# EAGLE design tarjeta-v3 (EAGLE 6.4)
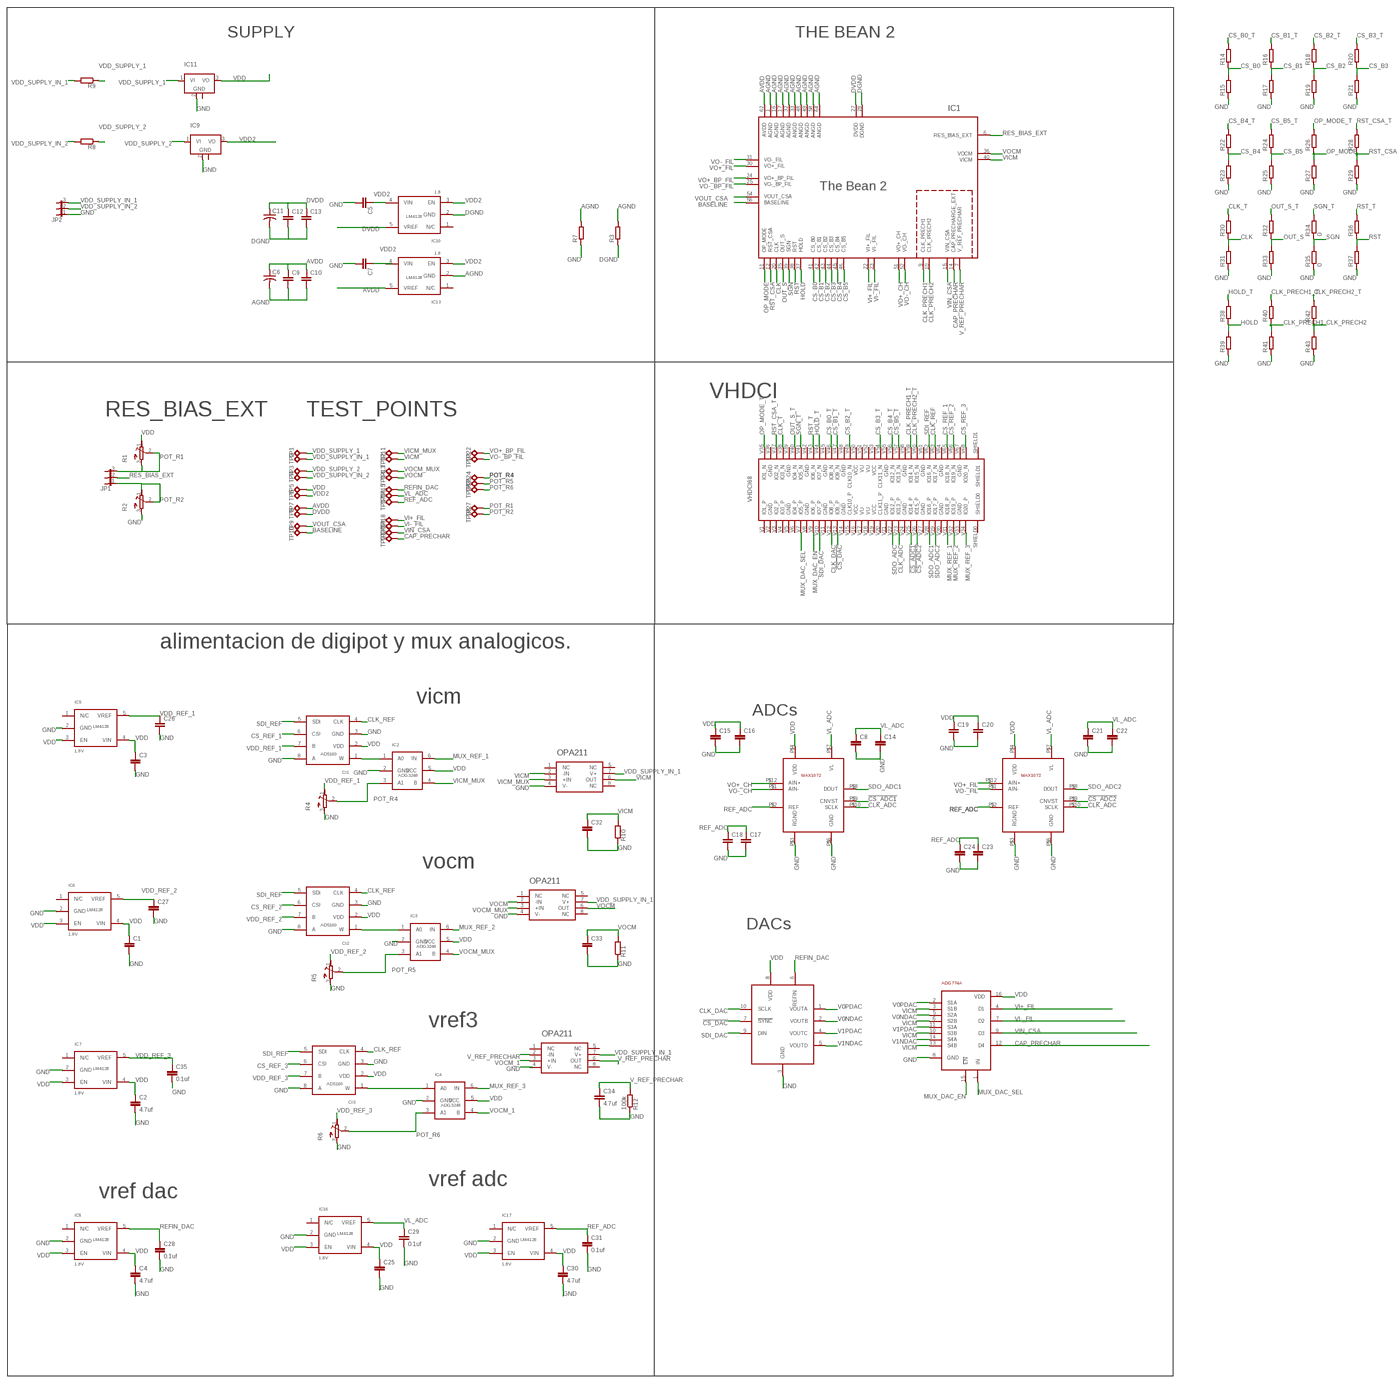
[diagram p0: schematic, sheet 1, overview]
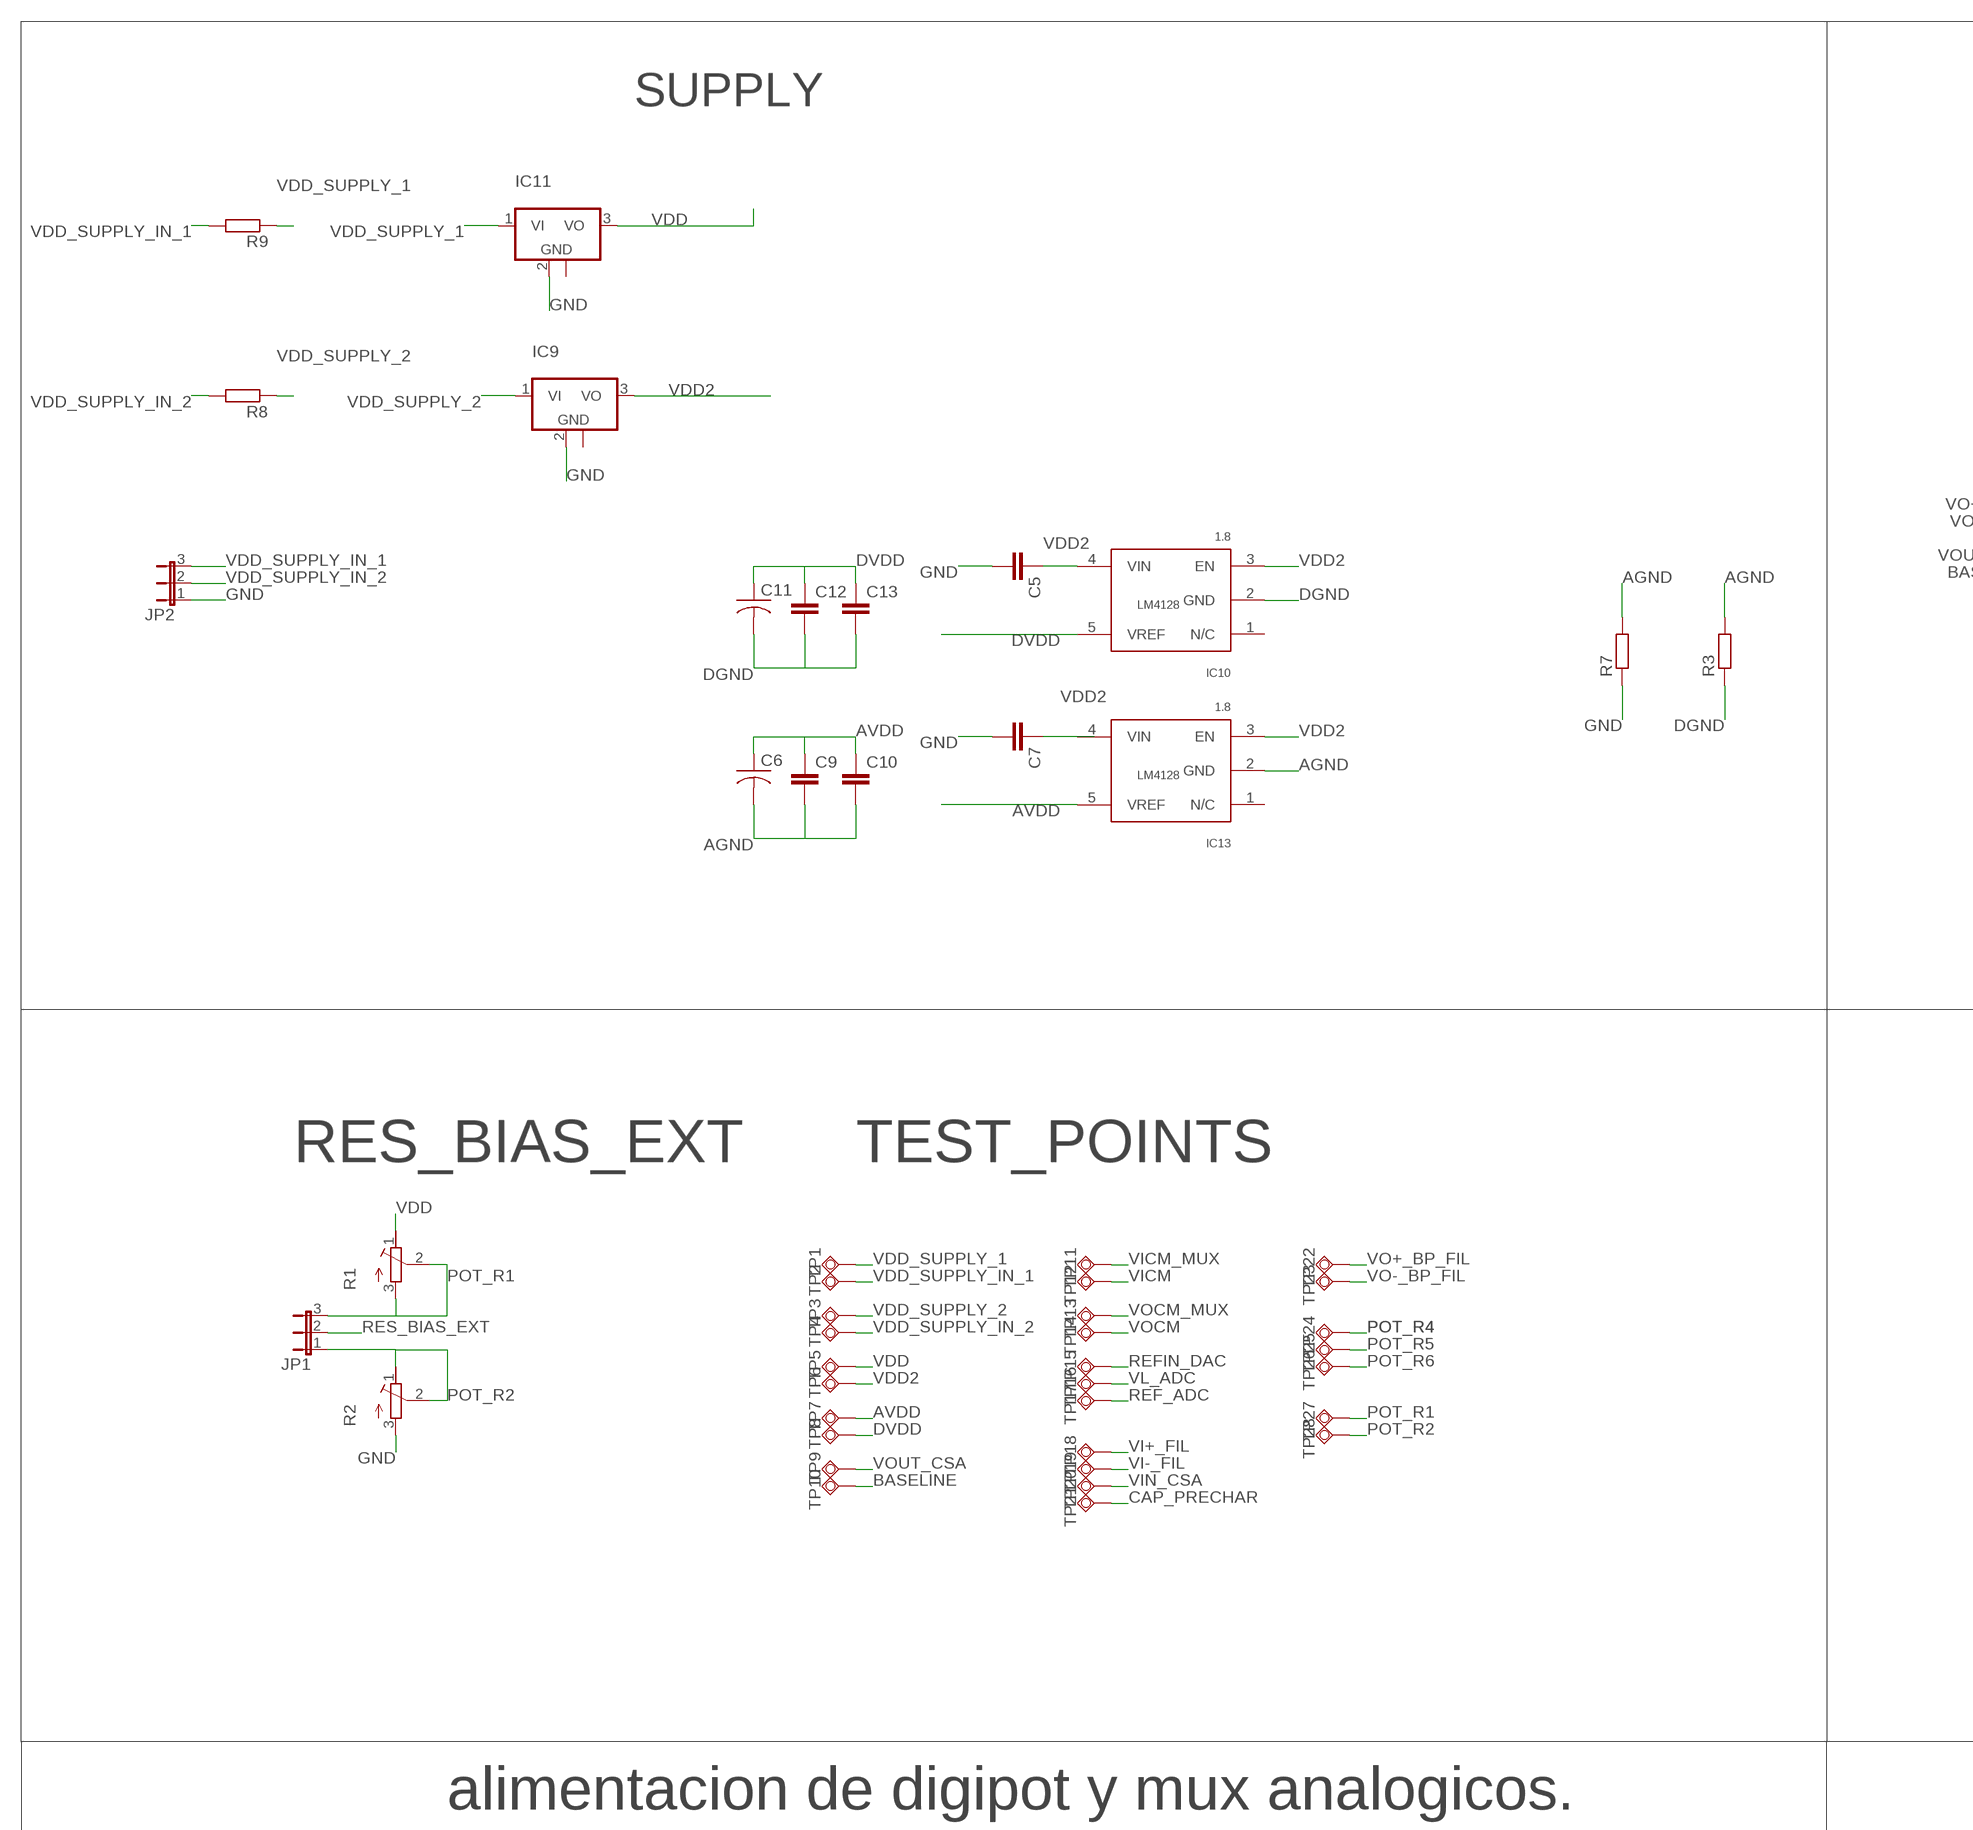
[diagram p1: schematic, sheet 1, part 1 of 4]
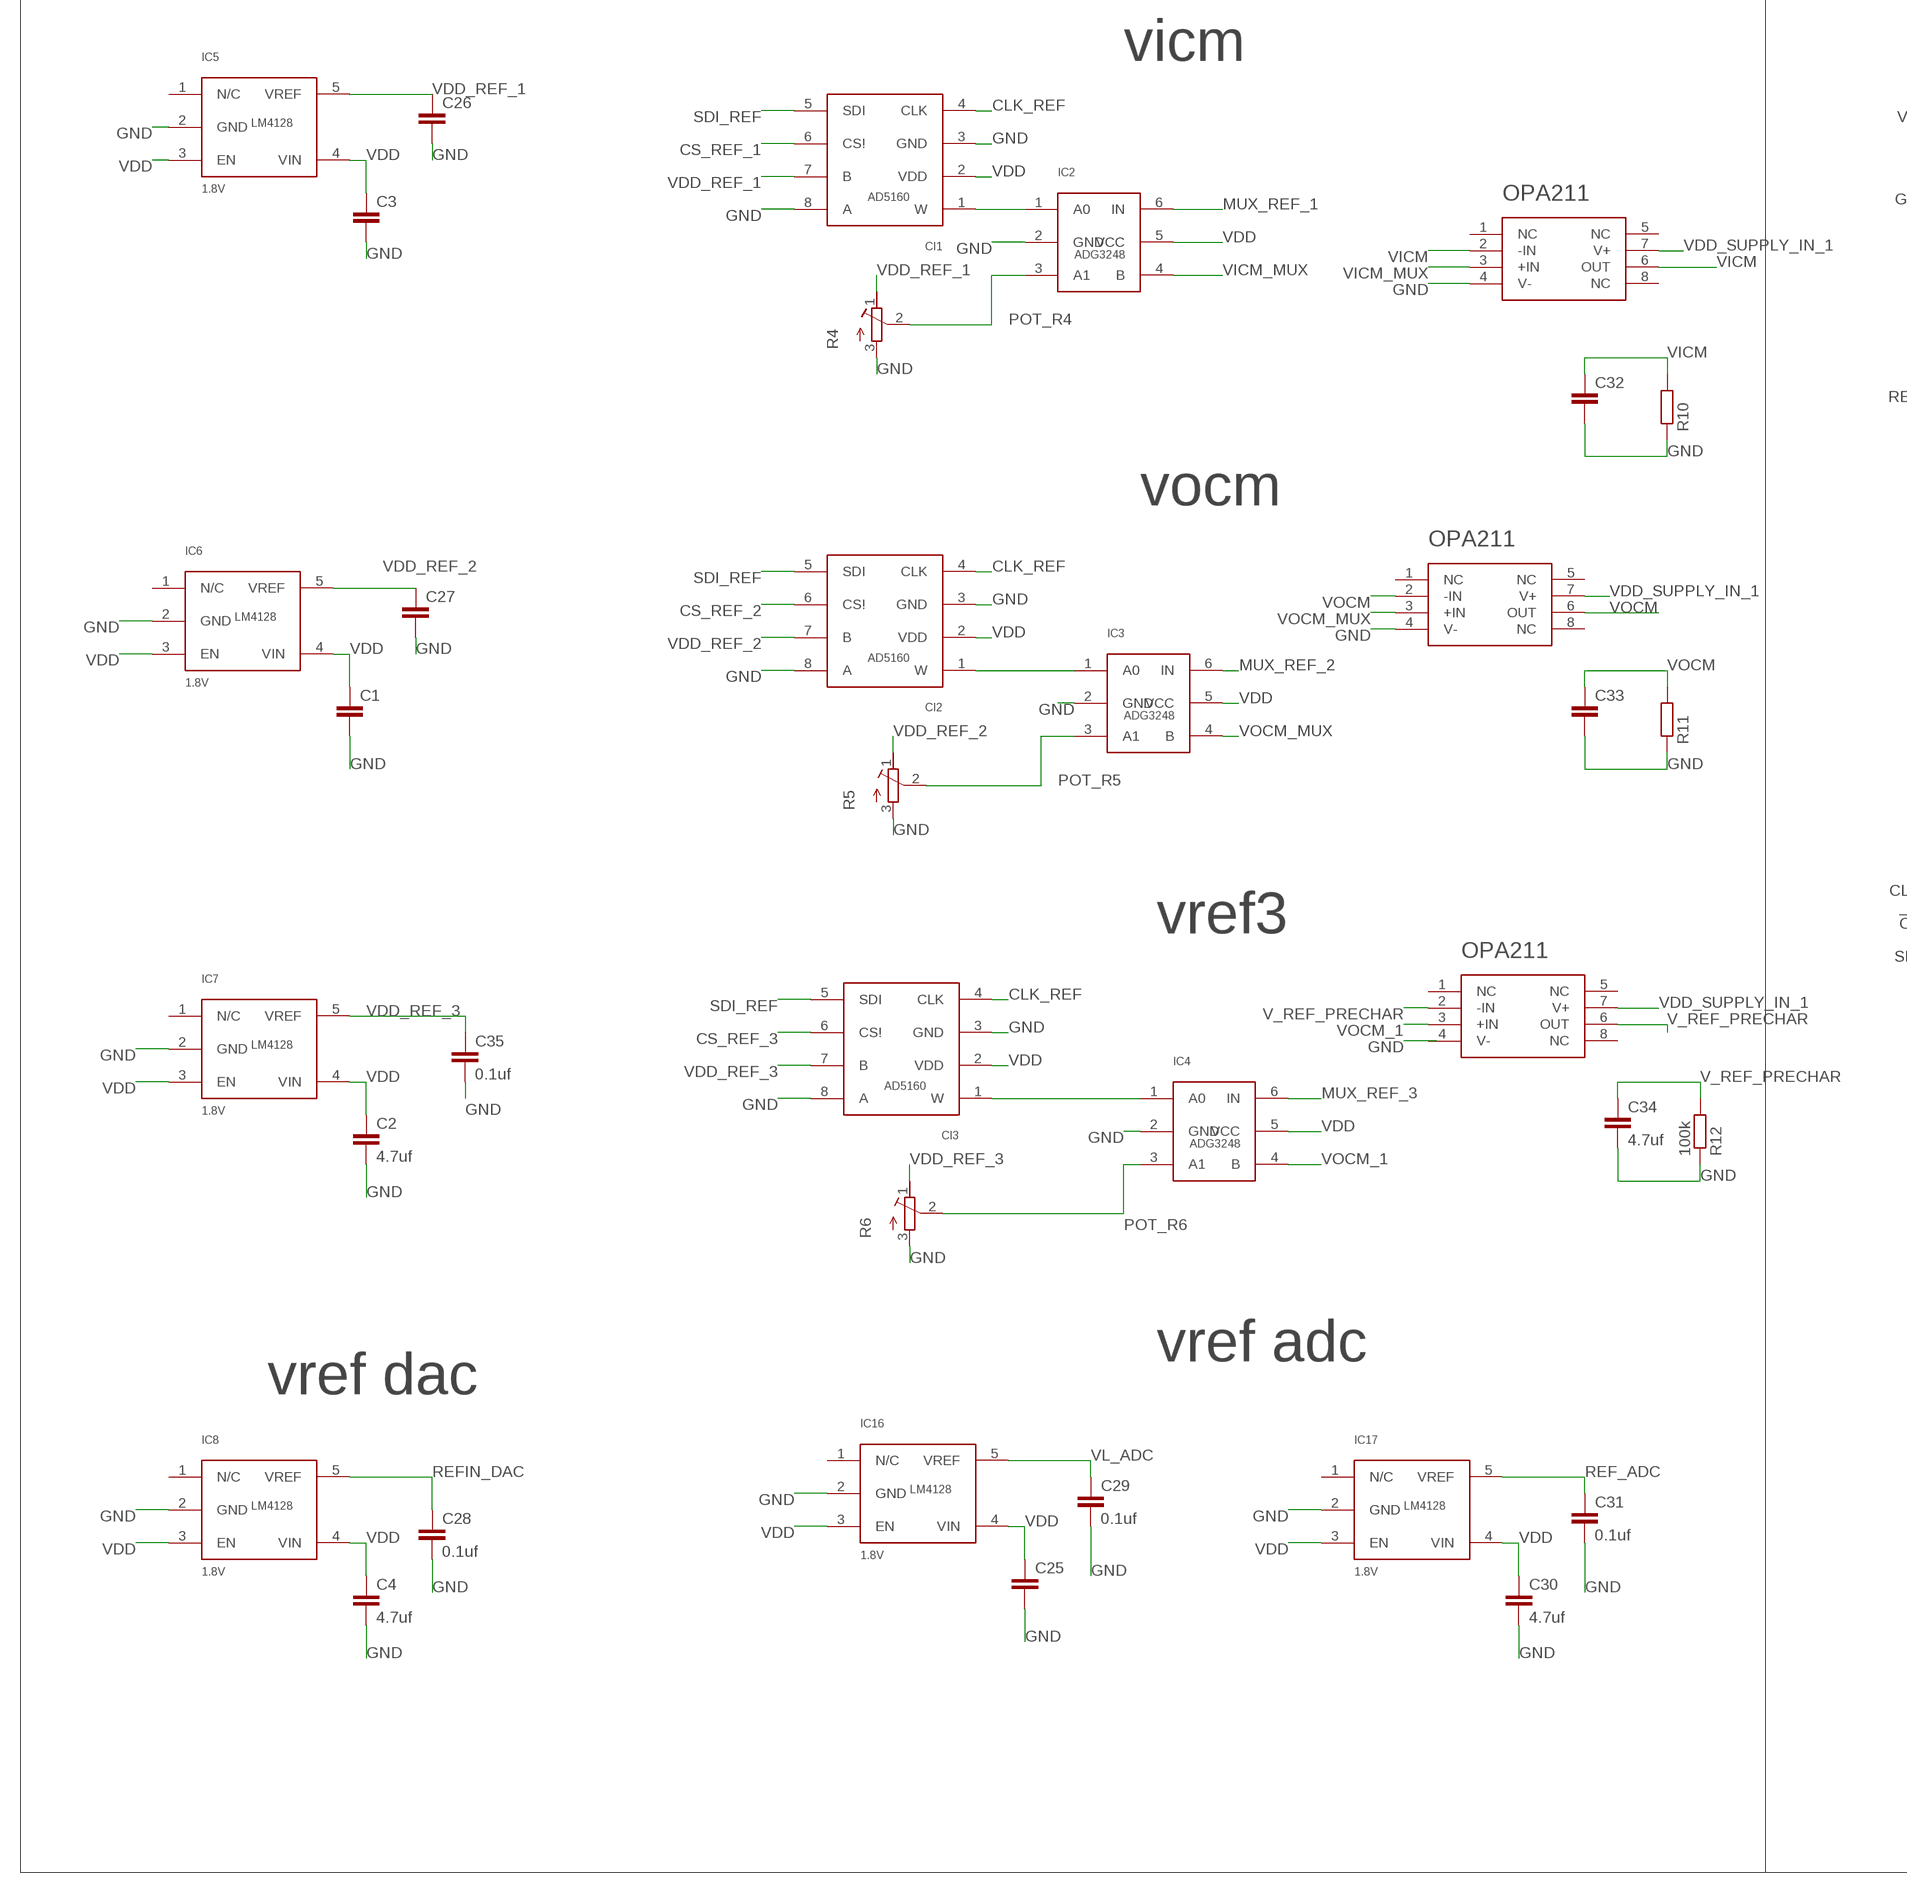
[diagram p2: schematic, sheet 1, part 2 of 4]
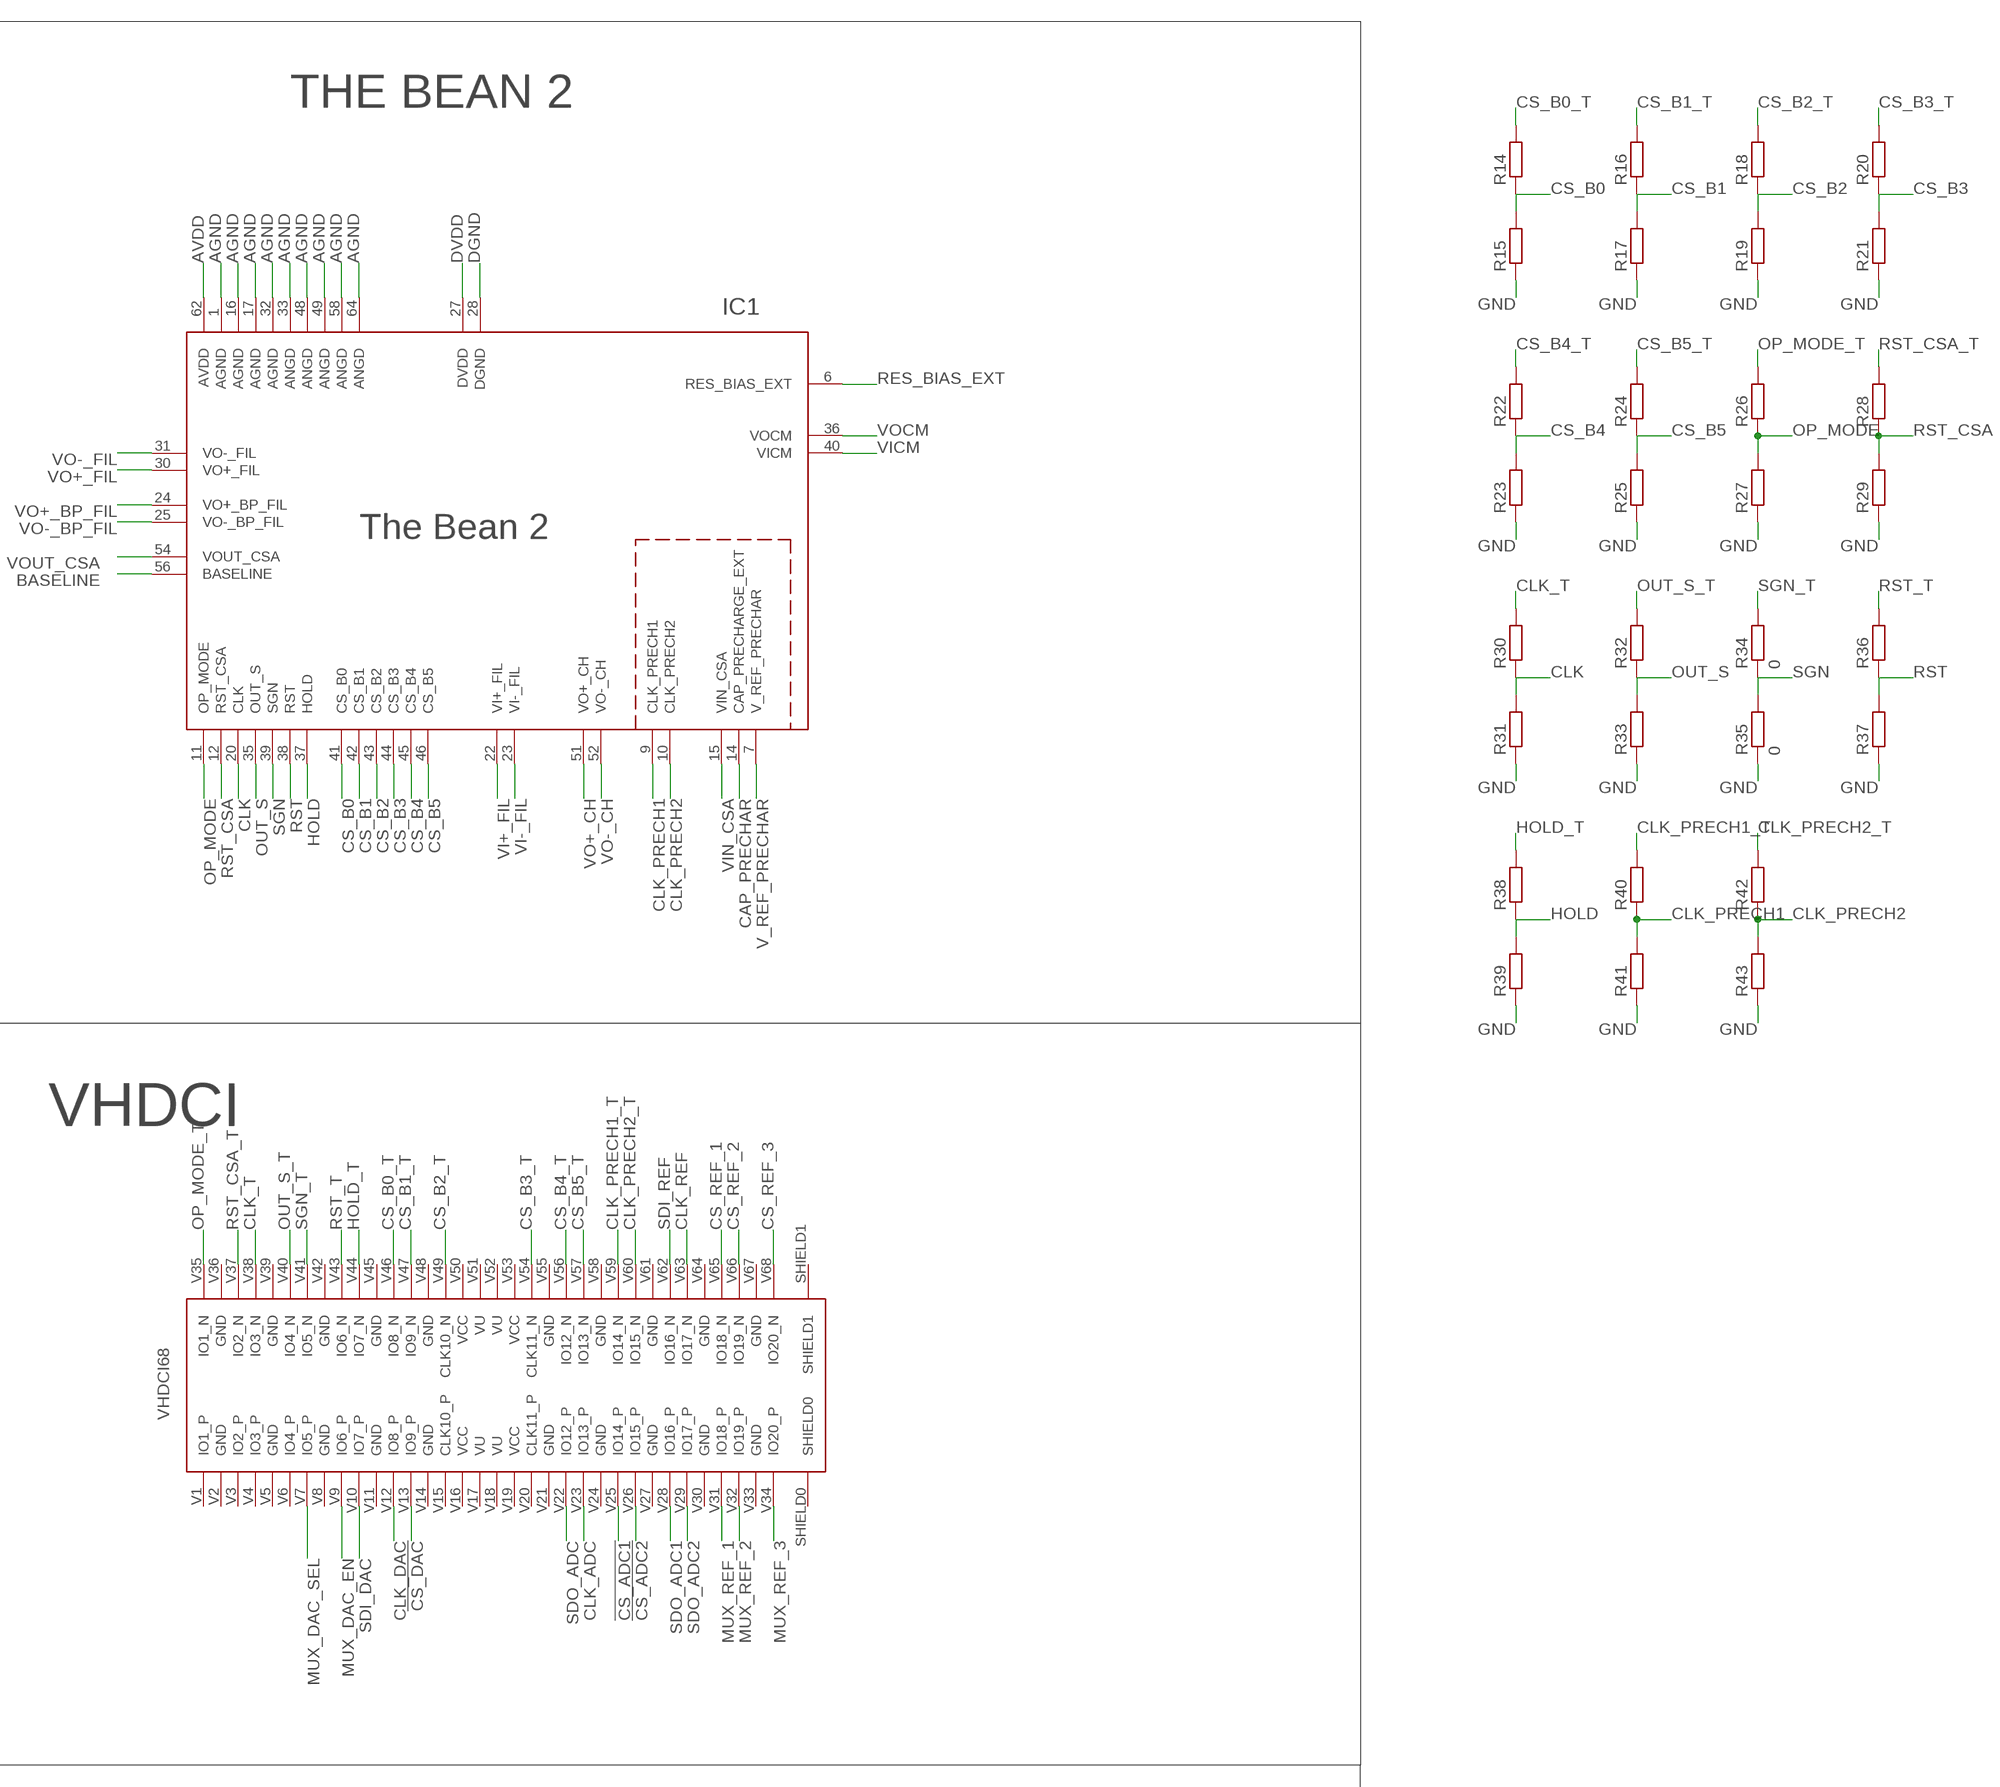
[diagram p3: schematic, sheet 1, part 3 of 4]
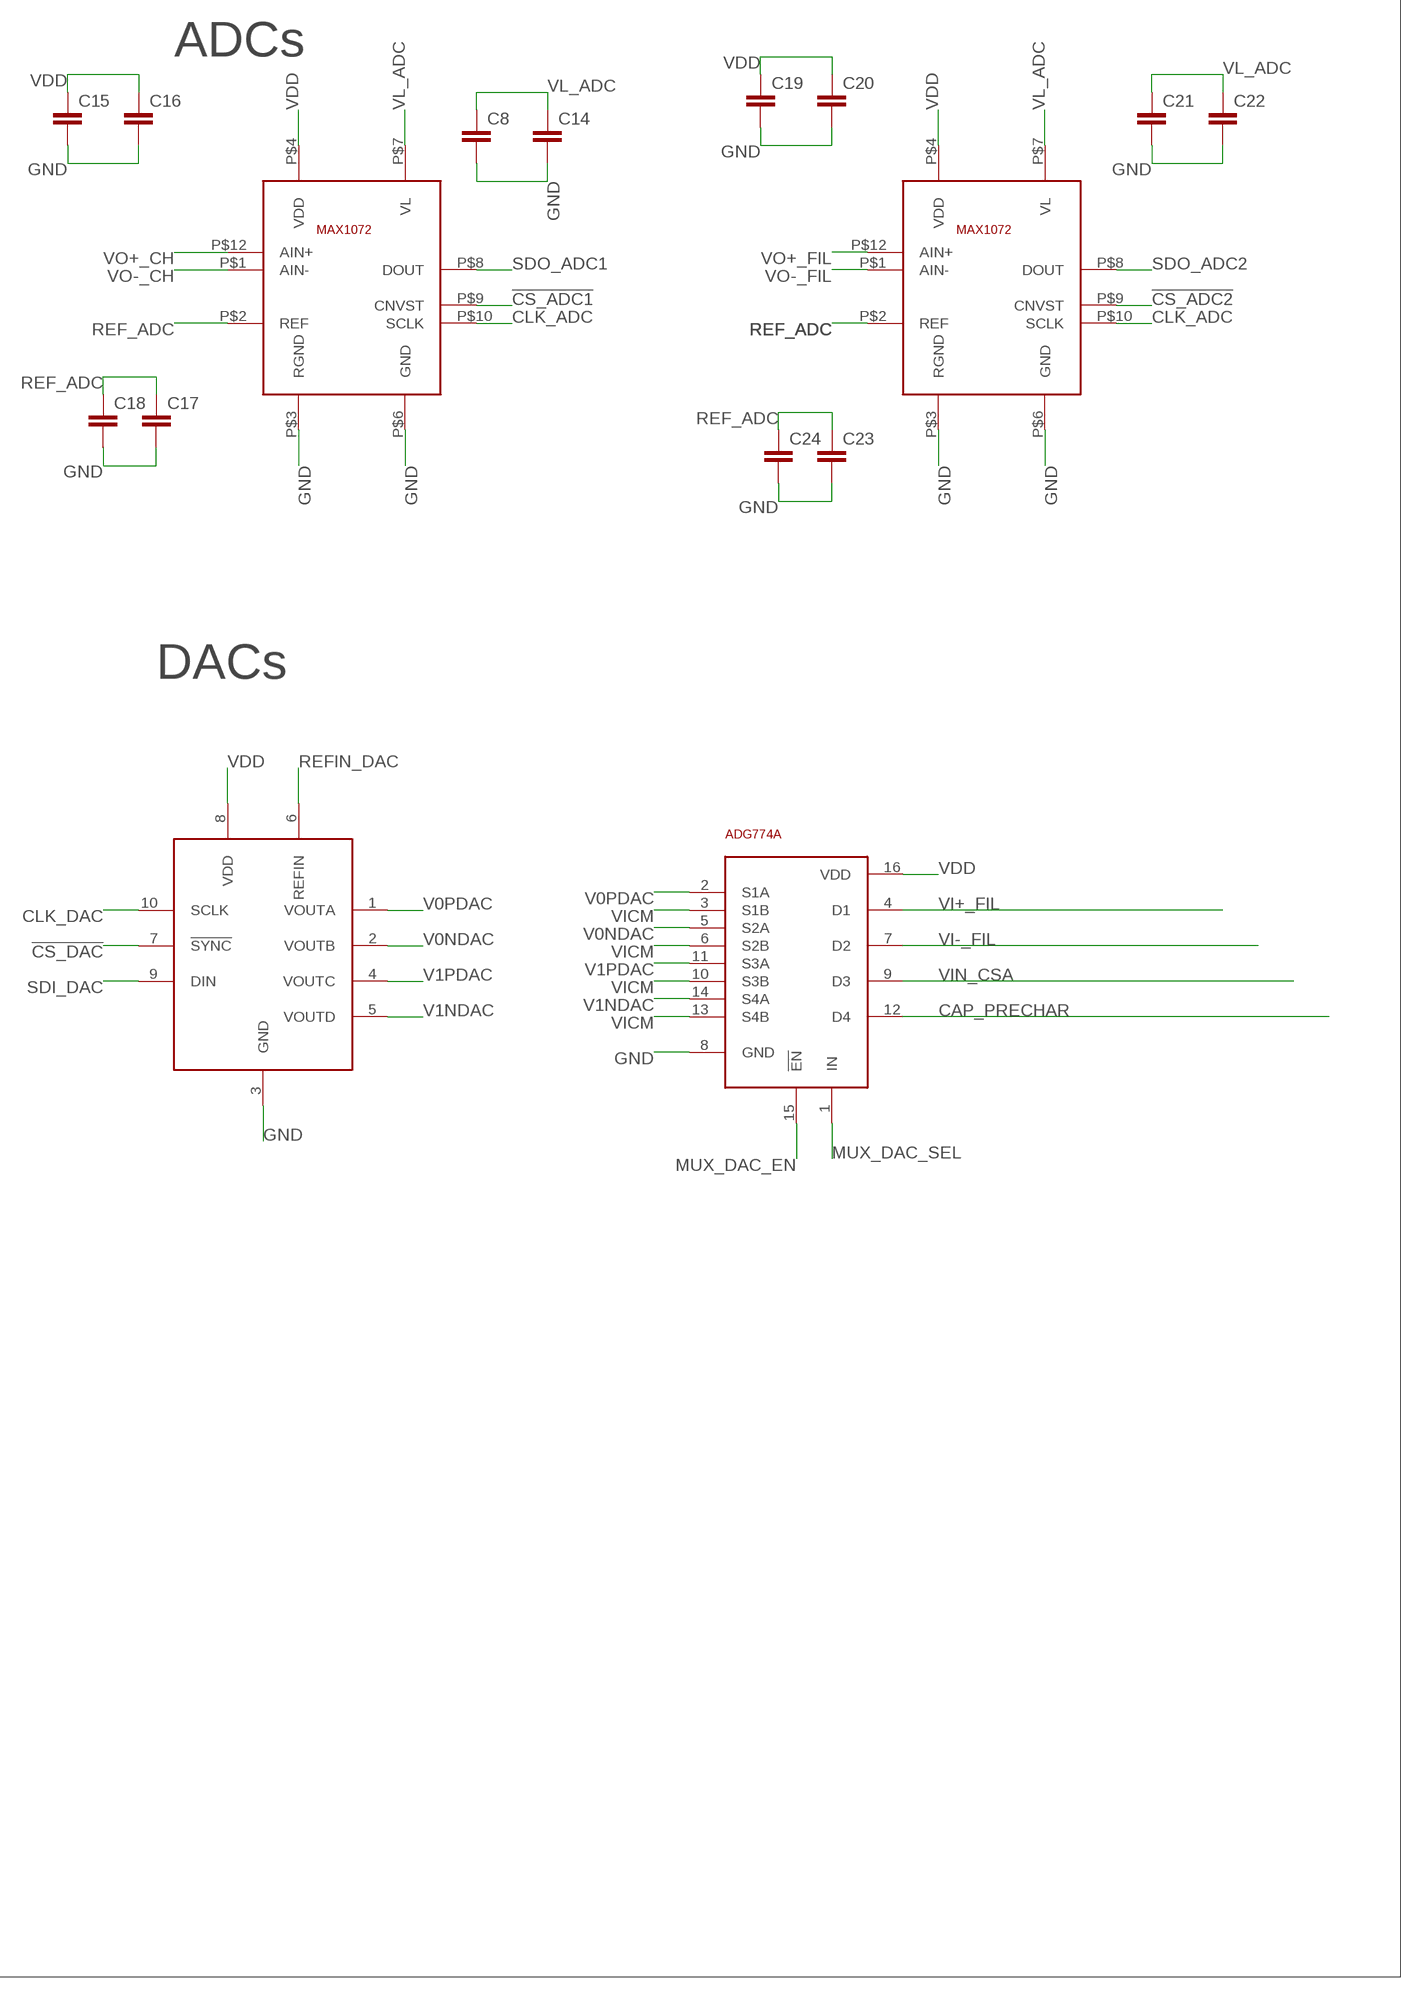
[diagram p4: schematic, sheet 1, part 4 of 4]

## Parts
C1  C-EUC0402  [C0402]
C2  4.7uf  C-EUC0402  [C0402]
C3  C-EUC0402  [C0402]
C4  4.7uf  C-EUC0402  [C0402]
C5  C-EUC0402  [C0402]
C6  C-USC0805  [C0805]
C7  C-EUC0402  [C0402]
C8  C-EUC0402  [C0402]
C9  C-EUC0402  [C0402]
C10  C-EUC0402  [C0402]
C11  C-USC0805  [C0805]
C12  C-EUC0402  [C0402]
C13  C-EUC0402  [C0402]
C14  C-EUC0402  [C0402]
C15  C-EUC0402  [C0402]
C16  C-EUC0402  [C0402]
C17  C-EUC0402  [C0402]
C18  C-EUC0402  [C0402]
C19  C-EUC0402  [C0402]
C20  C-EUC0402  [C0402]
C21  C-EUC0402  [C0402]
C22  C-EUC0402  [C0402]
C23  C-EUC0402  [C0402]
C24  C-EUC0402  [C0402]
C25  C-EUC0402  [C0402]
C26  C-EUC0402  [C0402]
C27  C-EUC0402  [C0402]
C28  0.1uf  C-EUC0402  [C0402]
C29  0.1uf  C-EUC0402  [C0402]
C30  4.7uf  C-EUC0402  [C0402]
C31  0.1uf  C-EUC0402  [C0402]
C32  C-EUC0402  [C0402]
C33  C-EUC0402  [C0402]
C34  4.7uf  C-EUC0402  [C0402]
C35  0.1uf  C-EUC0402  [C0402]
CI1  AD5160  [SOT23-8]
CI2  AD5160  [SOT23-8]
CI3  AD5160  [SOT23-8]
IC1  THE_BEAN_2  [QFN64]
IC2  ADG3248  [SC70]
IC3  ADG3248  [SC70]
IC4  ADG3248  [SC70]
IC5  1.8V  LM4128  [SOT23-5L]
IC6  1.8V  LM4128  [SOT23-5L]
IC7  1.8V  LM4128  [SOT23-5L]
IC8  1.8V  LM4128  [SOT23-5L]
IC9  UA78M33DCY  [SOT223]
IC10  1.8  LM4128  [SOT23-5L]
IC11  UA78M33DCY  [SOT223]
IC12  OPA211  [SOIC8]
IC13  1.8  LM4128  [SOT23-5L]
IC14  OPA211  [SOIC8]
IC15  OPA211  [SOIC8]
IC16  1.8V  LM4128  [SOT23-5L]
IC17  1.8V  LM4128  [SOT23-5L]
JP1  JP2E  [JP2]
JP2  JP2E  [JP2]
R1  TRIMMER_ST5  [ST-5EW]
R2  TRIMMER_ST5  [ST-5EW]
R3  R-EU_R0402  [R0402]
R4  TRIMMER_ST5  [ST-5EW]
R5  TRIMMER_ST5  [ST-5EW]
R6  TRIMMER_ST5  [ST-5EW]
R7  R-EU_R0402  [R0402]
R8  R-EU_R0402  [R0402]
R9  R-EU_R0402  [R0402]
R10  R-EU_R0402  [R0402]
R11  R-EU_R0402  [R0402]
R12  100k  R-EU_R0402  [R0402]
R14  R-EU_R0402  [R0402]
R15  R-EU_R0402  [R0402]
R16  R-EU_R0402  [R0402]
R17  R-EU_R0402  [R0402]
R18  R-EU_R0402  [R0402]
R19  R-EU_R0402  [R0402]
R20  R-EU_R0402  [R0402]
R21  R-EU_R0402  [R0402]
R22  R-EU_R0402  [R0402]
R23  R-EU_R0402  [R0402]
R24  R-EU_R0402  [R0402]
R25  R-EU_R0402  [R0402]
R26  R-EU_R0402  [R0402]
R27  R-EU_R0402  [R0402]
R28  R-EU_R0402  [R0402]
R29  R-EU_R0402  [R0402]
R30  R-EU_R0402  [R0402]
R31  R-EU_R0402  [R0402]
R32  R-EU_R0402  [R0402]
R33  R-EU_R0402  [R0402]
R34  0  R-EU_R0402  [R0402]
R35  0  R-EU_R0402  [R0402]
R36  R-EU_R0402  [R0402]
R37  R-EU_R0402  [R0402]
R38  R-EU_R0402  [R0402]
R39  R-EU_R0402  [R0402]
R40  R-EU_R0402  [R0402]
R41  R-EU_R0402  [R0402]
R42  R-EU_R0402  [R0402]
R43  R-EU_R0402  [R0402]
TP1  TEST_POINT  [TP]
TP2  TEST_POINT  [TP]
TP3  TEST_POINT  [TP]
TP4  TEST_POINT  [TP]
TP5  TEST_POINT  [TP]
TP6  TEST_POINT  [TP]
TP7  TEST_POINT  [TP]
TP8  TEST_POINT  [TP]
TP9  TEST_POINT  [TP]
TP10  TEST_POINT  [TP]
TP11  TEST_POINT  [TP]
TP12  TEST_POINT  [TP]
TP13  TEST_POINT  [TP]
TP14  TEST_POINT  [TP]
TP15  TEST_POINT  [TP]
TP16  TEST_POINT  [TP]
TP17  TEST_POINT  [TP]
TP18  TEST_POINT  [TP]
TP19  TEST_POINT  [TP]
TP20  TEST_POINT  [TP]
TP21  TEST_POINT  [TP]
TP22  TEST_POINT  [TP]
TP23  TEST_POINT  [TP]
TP24  TEST_POINT  [TP]
TP25  TEST_POINT  [TP]
TP26  TEST_POINT  [TP]
TP27  TEST_POINT  [TP]
TP28  TEST_POINT  [TP]
U$1  ADG774A  [QSOP16]
U$2  VHDCI68  [VHDCI68]
U$3  MAX1072  [TQFN12]
U$4  DAC7554  [MSOP10]
U$5  MAX1072  [TQFN12]

## Nets
!CS_ADC1: U$2.V25(IO14_P) U$3.P$9(CNVST)
!CS_ADC2: U$2.V26(IO15_P) U$5.P$9(CNVST)
!CS_DAC: U$2.V13(IO9_P) U$4.7(!SYNC)
AGND: C6.2 C9.2 C10.2 IC1.1(AGND) IC1.16(AGND) IC1.17(AGND) IC1.32(AGND) IC1.33(ANGD) IC1.48(ANGD) IC1.49(ANGD) IC1.58(ANGD) IC1.64(ANGD) IC13.2(GND) R3.2 R7.2
AVDD: C6.1 C9.1 C10.1 IC1.62(AVDD) IC13.5(VREF) TP7.TP
BASELINE: IC1.56(BASELINE) TP10.TP
CAP_PRECHAR: IC1.14(CAP_PRECHARGE_EXT) TP21.TP U$1.12(D4)
CLK: IC1.20(CLK) R30.1 R31.2
CLK_ADC: U$2.V23(IO13_P) U$3.P$10(SCLK) U$5.P$10(SCLK)
CLK_DAC: U$2.V12(IO8_P) U$4.10(SCLK)
CLK_PRECH1: IC1.9(CLK_PRECH1) R40.1 R41.2
CLK_PRECH1_T: R40.2 U$2.V59(IO14_N)
CLK_PRECH2: IC1.10(CLK_PRECH2) R42.1 R43.2
CLK_PRECH2_T: R42.2 U$2.V60(IO15_N)
CLK_REF: CI1.4(CLK) CI2.4(CLK) CI3.4(CLK) U$2.V63(IO17_N)
CLK_T: R30.2 U$2.V38(IO3_N)
CS_B0: IC1.41(CS_B0) R14.1 R15.2
CS_B0_T: R14.2 U$2.V46(IO8_N)
CS_B1: IC1.42(CS_B1) R16.1 R17.2
CS_B1_T: R16.2 U$2.V47(IO9_N)
CS_B2: IC1.43(CS_B2) R18.1 R19.2
CS_B2_T: R18.2 U$2.V49(CLK10_N)
CS_B3: IC1.44(CS_B3) R20.1 R21.2
CS_B3_T: R20.2 U$2.V54(CLK11_N)
CS_B4: IC1.45(CS_B4) R22.1 R23.2
CS_B4_T: R22.2 U$2.V56(IO12_N)
CS_B5: IC1.46(CS_B5) R24.1 R25.2
CS_B5_T: R24.2 U$2.V57(IO13_N)
CS_REF_1: CI1.6(CS!) U$2.V65(IO18_N)
CS_REF_2: CI2.6(CS!) U$2.V66(IO19_N)
CS_REF_3: CI3.6(CS!) U$2.V68(IO20_N)
DGND: C11.2 C12.2 C13.2 IC1.28(DGND) IC10.2(GND) R3.1
DVDD: C11.1 C12.1 C13.1 IC1.27(DVDD) IC10.5(VREF) TP8.TP
GND: C1.2 C2.2 C3.2 C4.2 C5.2 C7.2 C8.2 C14.2 C15.2 C16.2 C17.2 C18.2 C19.2 C20.2 C21.2 C22.2 C23.2 C24.2 C25.2 C26.2 C27.2 C28.2 C29.2 C30.2 C31.2 C32.2 C33.2 C34.2 C35.2 CI1.3(GND) CI1.8(A) CI2.3(GND) CI2.8(A) CI3.3(GND) CI3.8(A) IC2.2(GND) IC3.2(GND) IC4.2(GND) IC5.2(GND) IC6.2(GND) IC7.2(GND) IC8.2(GND) IC9.2(GND) IC11.2(GND) IC12.4(V-) IC16.2(GND) IC17.2(GND) JP2.1 R2.3 R4.3 R5.3 R6.3 R7.1 R10.1 R11.1 R12.1 R15.1 R17.1 R19.1 R21.1 R23.1 R25.1 R27.1 R29.1 R31.1 R33.1 R35.1 R37.1 R39.1 R41.1 R43.1 U$1.8(GND) U$3.P$3(RGND) U$3.P$6(GND) U$4.3(GND) U$5.P$3(RGND) U$5.P$6(GND)
HOLD: IC1.37(HOLD) R38.1 R39.2
HOLD_T: R38.2 U$2.V44(IO7_N)
MUX_DAC_EN: U$1.15(!EN) U$2.V9(IO6_P)
MUX_DAC_SEL: U$1.1(IN) U$2.V7(IO5_P)
MUX_REF_1: IC2.6(IN) U$2.V31(IO18_P)
MUX_REF_2: IC3.6(IN) U$2.V32(IO19_P)
MUX_REF_3: IC4.6(IN) U$2.V34(IO20_P)
N$5: CI3.1(W) IC4.1(A0)
N$17: CI1.1(W) IC2.1(A0)
N$19: CI2.1(W) IC3.1(A0)
OP_MODE: IC1.11(OP_MODE) R26.1 R27.2
OP_MODE_T: R26.2 U$2.V35(IO1_N)
OUT_S: IC1.35(OUT_S) R32.1 R33.2
OUT_S_T: R32.2 U$2.V40(IO4_N)
POT_R1: JP1.3 R1.2 R1.3 TP27.TP
POT_R2: JP1.1 R2.1 R2.2 TP28.TP
POT_R4: IC2.3(A1) R4.2 TP24.TP
POT_R5: IC3.3(A1) R5.2 TP25.TP
POT_R6: IC4.3(A1) R6.2 TP26.TP
REF_ADC: C17.1 C18.1 C23.1 C24.1 C31.1 IC17.5(VREF) TP17.TP U$3.P$2(REF) U$5.P$2(REF)
REFIN_DAC: IC8.5(VREF) TP15.TP U$4.6(REFIN)
RES_BIAS_EXT: IC1.6(RES_BIAS_EXT) JP1.2
RST: IC1.38(RST) R36.1 R37.2
RST_CSA: IC1.12(RST_CSA) R28.1 R29.2
RST_CSA_T: R28.2 U$2.V37(IO2_N)
RST_T: R36.2 U$2.V43(IO6_N)
SDI_DAC: U$2.V10(IO7_P) U$4.9(DIN)
SDI_REF: CI1.5(SDI) CI2.5(SDI) CI3.5(SDI) U$2.V62(IO16_N)
SDO_ADC: U$2.V22(IO12_P)
SDO_ADC1: U$2.V28(IO16_P) U$3.P$8(DOUT)
SDO_ADC2: U$2.V29(IO17_P) U$5.P$8(DOUT)
SGN: IC1.39(SGN) R34.1 R35.2
SGN_T: R34.2 U$2.V41(IO5_N)
V0NDAC: U$1.5(S2A) U$4.2(VOUTB)
V0PDAC: U$1.2(S1A) U$4.1(VOUTA)
V1NDAC: U$1.14(S4A) U$4.5(VOUTD)
V1PDAC: U$1.11(S3A) U$4.4(VOUTC)
V_REF_PRECHAR: C34.1 IC1.7(V_REF_PRECHAR) IC15.2(-IN) IC15.6(OUT) R12.2
VDD: C1.1 C2.1 C3.1 C4.1 C15.1 C16.1 C19.1 C20.1 C25.1 C30.1 CI1.2(VDD) CI2.2(VDD) CI3.2(VDD) IC2.5(VCC) IC3.5(VCC) IC4.5(VCC) IC5.3(EN) IC5.4(VIN) IC6.3(EN) IC6.4(VIN) IC7.3(EN) IC7.4(VIN) IC8.3(EN) IC8.4(VIN) IC11.3(VO) IC16.3(EN) IC16.4(VIN) IC17.3(EN) IC17.4(VIN) R1.1 TP5.TP U$1.16(VDD) U$3.P$4(VDD) U$4.8(VDD) U$5.P$4(VDD)
VDD1: C28.1
VDD2: C5.1 C7.1 IC9.3(VO) IC10.3(EN) IC10.4(VIN) IC13.3(EN) IC13.4(VIN) TP6.TP
VDD_REF_1: C26.1 CI1.7(B) IC5.5(VREF) R4.1
VDD_REF_2: C27.1 CI2.7(B) IC6.5(VREF) R5.1
VDD_REF_3: C35.1 CI3.7(B) IC7.5(VREF) R6.1
VDD_SUPPLY_1: IC11.1(VI) R9.1 TP1.TP
VDD_SUPPLY_2: IC9.1(VI) R8.1 TP3.TP
VDD_SUPPLY_IN_1: IC12.7(V+) IC14.7(V+) IC15.7(V+) JP2.3 R9.2 TP2.TP
VDD_SUPPLY_IN_2: JP2.2 R8.2 TP4.TP
VI+_FIL: IC1.22(VI+_FIL) TP18.TP U$1.4(D1)
VI-_FIL: IC1.23(VI-_FIL) TP19.TP U$1.7(D2)
VICM: C32.1 IC1.40(VICM) IC12.2(-IN) IC12.6(OUT) R10.2 TP12.TP U$1.3(S1B) U$1.6(S2B) U$1.10(S3B) U$1.13(S4B)
VICM_MUX: IC2.4(B) IC12.3(+IN) TP11.TP
VIN_CSA: IC1.15(VIN_CSA) TP20.TP U$1.9(D3)
VL_ADC: C8.1 C14.1 C21.1 C22.1 C29.1 IC16.5(VREF) TP16.TP U$3.P$7(VL) U$5.P$7(VL)
VO+_BP_FIL: IC1.24(VO+_BP_FIL) TP22.TP
VO+_CH: IC1.51(VO+_CH) U$3.P$12(AIN+)
VO+_FIL: IC1.30(VO+_FIL) U$5.P$12(AIN+)
VO-_BP_FIL: IC1.25(VO-_BP_FIL) TP23.TP
VO-_CH: IC1.52(VO-_CH) U$3.P$1(AIN-)
VO-_FIL: IC1.31(VO-_FIL) U$5.P$1(AIN-)
VOCM: C33.1 IC1.36(VOCM) IC14.2(-IN) IC14.6(OUT) R11.2 TP14.TP
VOCM_1: IC4.4(B) IC15.3(+IN)
VOCM_MUX: IC3.4(B) IC14.3(+IN) TP13.TP
VOUT_CSA: IC1.54(VOUT_CSA) TP9.TP
Unconnected: IC5.1(N/C) IC6.1(N/C) IC7.1(N/C) IC8.1(N/C) IC9.4(GND) IC10.1(N/C) IC11.4(GND) IC12.1(NC) IC12.5(NC) IC12.8(NC) IC13.1(N/C) IC14.1(NC) IC14.4(V-) IC14.5(NC) IC14.8(NC) IC15.1(NC) IC15.4(V-) IC15.5(NC) IC15.8(NC) IC16.1(N/C) IC17.1(N/C) U$2.SHIELD0 U$2.SHIELD1 U$2.V1(IO1_P) U$2.V2(GND) U$2.V3(IO2_P) U$2.V4(IO3_P) U$2.V5(GND) U$2.V6(IO4_P) U$2.V8(GND) U$2.V11(GND) U$2.V14(GND) U$2.V15(CLK10_P) U$2.V20(CLK11_P) U$2.V21(GND) U$2.V24(GND) U$2.V27(GND) U$2.V30(GND) U$2.V33(GND) U$2.V36(GND) U$2.V39(GND) U$2.V42(GND) U$2.V45(GND) U$2.V48(GND) U$2.V55(GND) U$2.V58(GND) U$2.V61(GND) U$2.V64(GND) U$2.V67(GND)

## Notes on the sheet
- SUPPLY | THE BEAN 2
- VHDCI
- RES_BIAS_EXT | TEST_POINTS
- alimentacion de digipot y mux analogicos.
- vicm
- ADCs
- vocm
- DACs
- vref3
- vref adc
- vref dac

## Power pins joined to a net without a drawn wire
VCC: U$2.V16(VCC) U$2.V19(VCC) U$2.V50(VCC) U$2.V53(VCC)
VU: U$2.V17(VU) U$2.V18(VU) U$2.V51(VU) U$2.V52(VU)

## Library data of the parts
C1-C5 C7-C10 C12-C35 = rcl:C-EU: CAPACITOR, European symbol
C6 C11 = rcl:C-US: CAPACITOR, American symbol
CI1-CI3 = wac:AD5160: Digital potenciometer, package SOT23-8
IC1 = wac:THE_BEAN_2
IC2-IC4 = wac:ADG3248
IC5-IC8 IC10 IC13 IC16 IC17 = wac:LM4128
IC9 IC11 = linear:UA78M*: POSITIVE-VOLTAGE REGULATORS Source: http://focus.ti.com/lit/ds/symlink/ua78m33.pdf
IC12 IC14 IC15 = wac:OPA211
JP1 JP2 = jumper:JP2E: JUMPER
R1 R2 R4-R6 = wac:TRIMMER_ST5
R3 R7-R12 R14-R43 = rcl:R-EU_: RESISTOR, European symbol
TP1-TP28 = wac:TEST_POINT
U$1 = wac:ADG774A: Low voltage,400MHz, Quad 2:1 MUX with 3ns Switching Time http://www.analog.com/static/imported-files/data_sheets/ADG774A.pdf
U$2 = tw:VHDCI68: Nexys 3 VHDCI 68pin 0.8mm pitch
U$3 U$5 = wac:MAX1072
U$4 = wac:DAC7554: 12-BIT, QUAD, ULTRALOW GLITCH, VOLTAGE OUTPUT DIGITAL-TO-ANALOG CONVERTER http://www.ti.com/lit/ds/symlink/dac7554.pdf

## Board
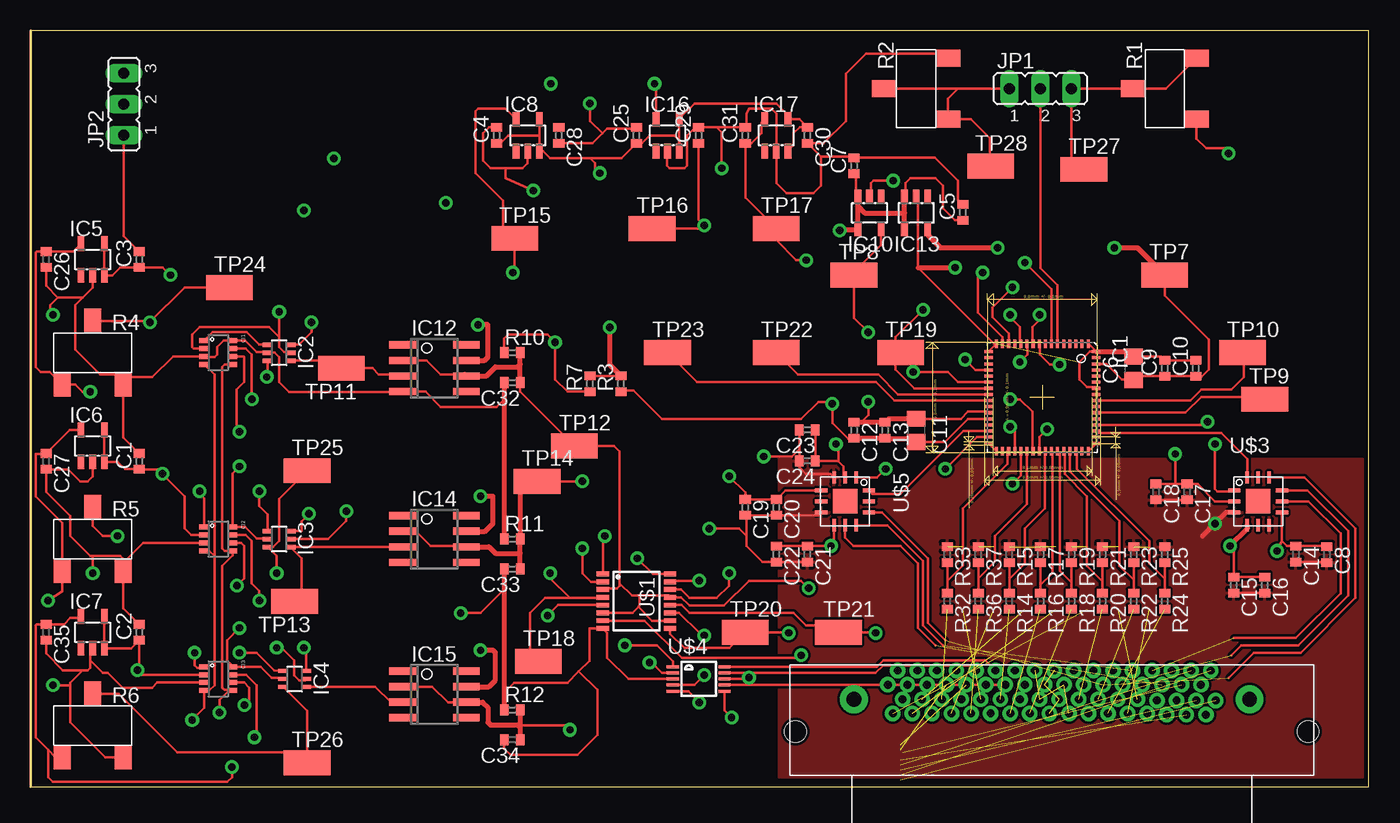
[diagram p5: board, top side]
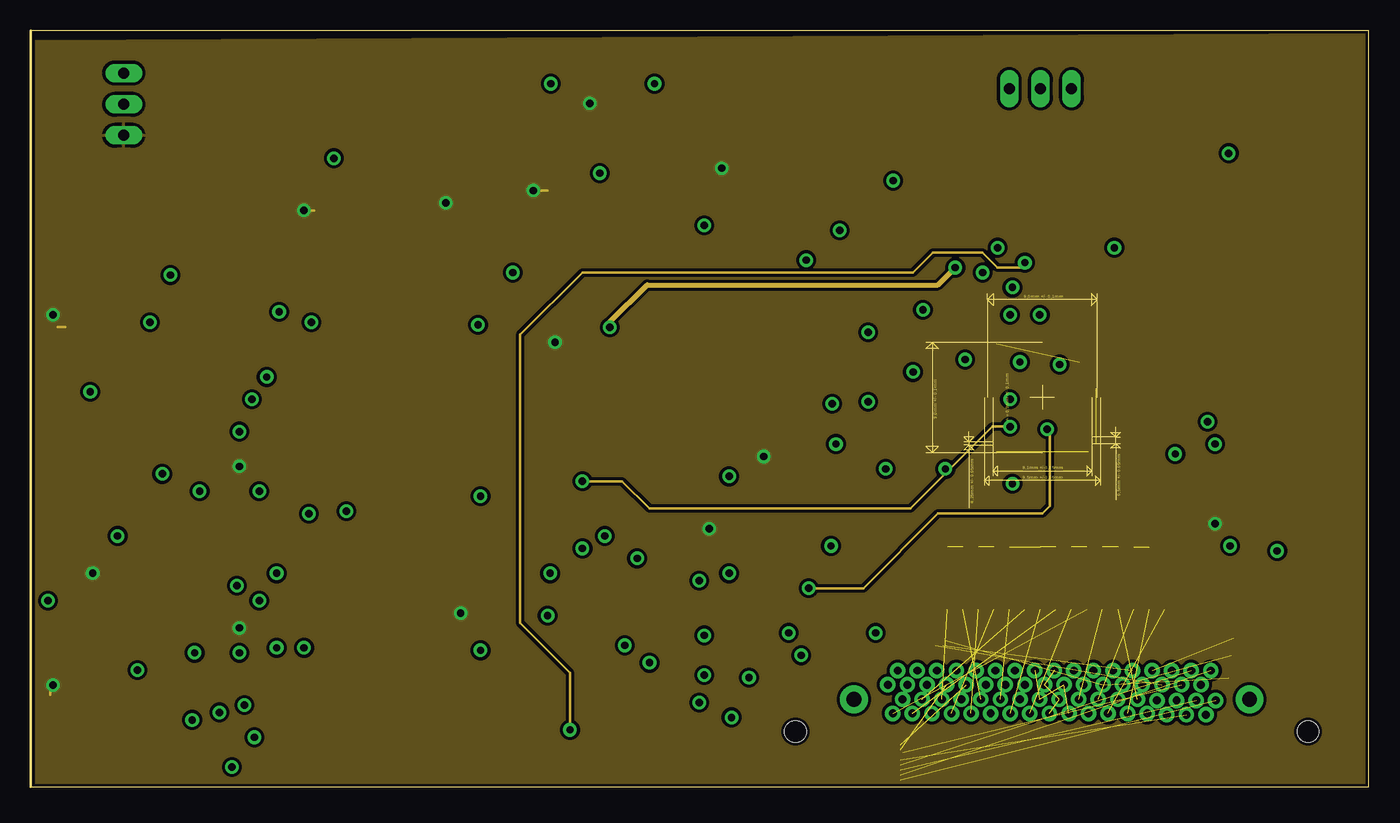
[diagram p6: board, inner layer Route2]
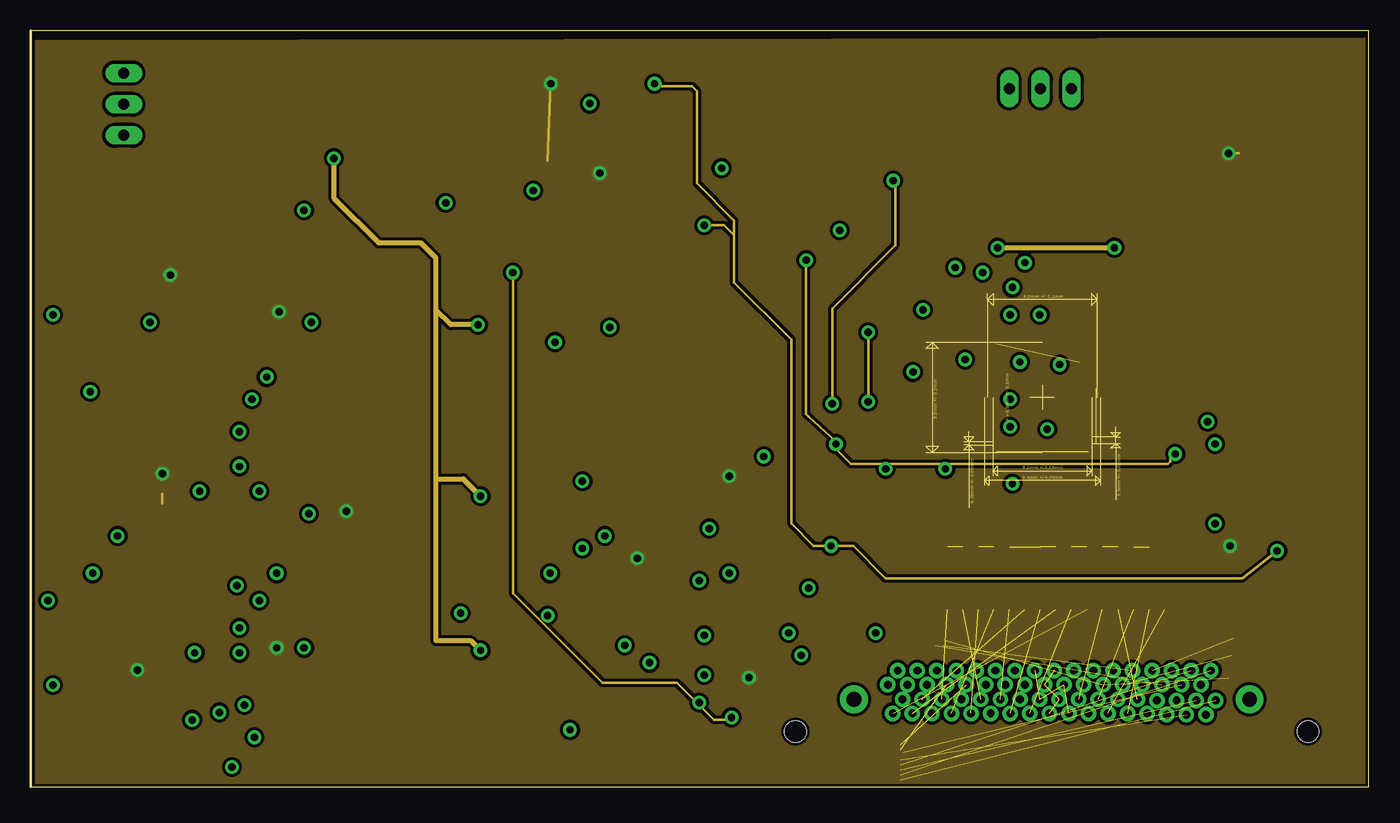
[diagram p7: board, inner layer Route3]
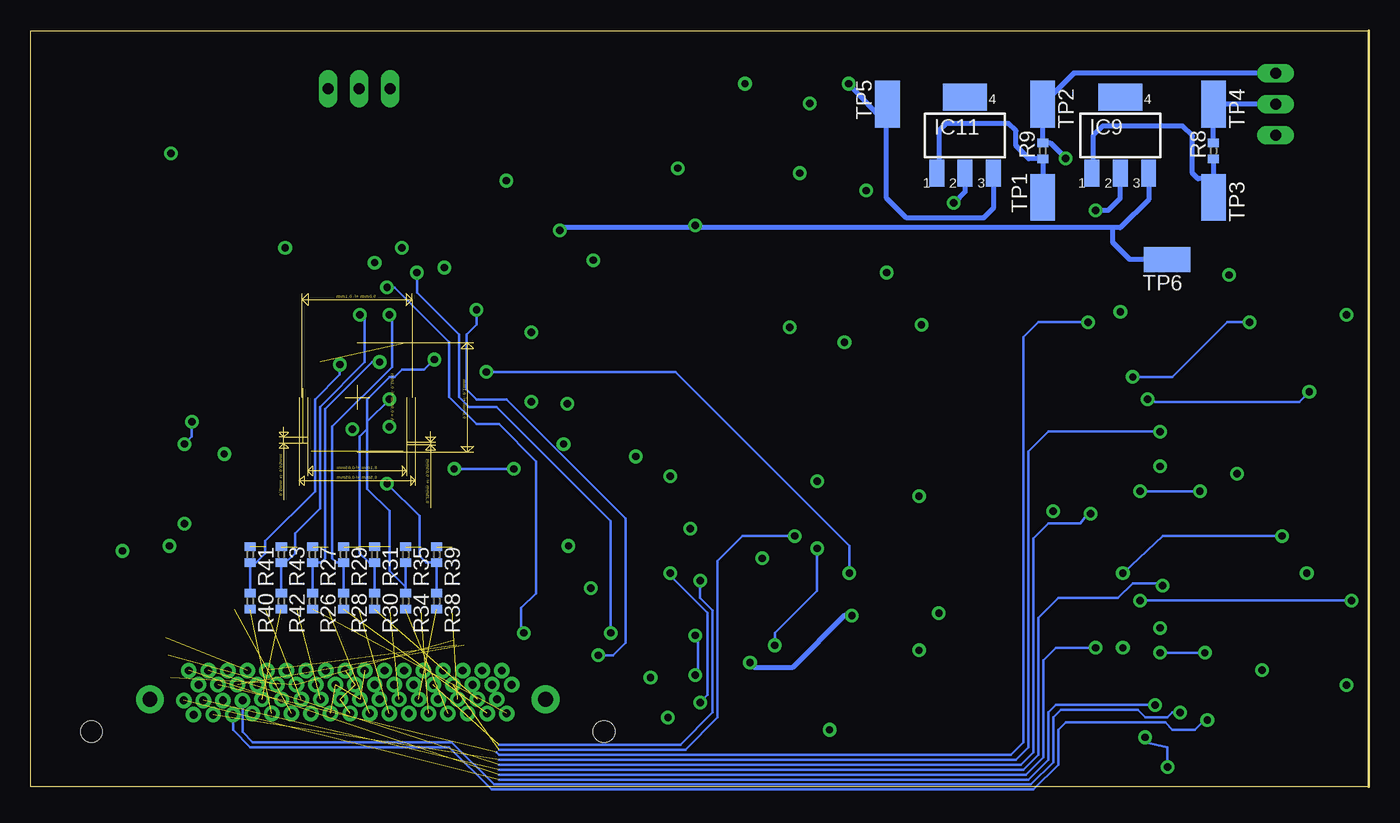
[diagram p8: board, bottom side, seen from below]

Size 109.4 x 61.85 mm. Coordinates in mm from the lower left corner, seen from the top.
Outline: 0,0 109.4,0 109.4,61.85 0,61.85 0,0
Copper layers [2:(1*2*3*16):3]: Top 0.035mm / dielectric 0.2mm / Route2 0.035mm / dielectric 0.8mm / Route3 0.035mm / dielectric 0.2mm / Bottom 0.035mm
Design rules "SparkFun": minimum track width 8mil, minimum drill 20mil, track to track 8mil, track to pad 8mil, pad to pad 8mil, via to via 8mil, smd to smd 8mil, copper to edge 10mil, drill to drill 8mil, minimum pad ring 12mil, minimum via ring 10mil, stop-mask expansion 4mil, vias tented up to drill 25mil, thermal gap 10mil

### Footprints (pad centres in the part's own frame; a part is rotated, then mirrored left to right if it is on the bottom)
C0402 = smd 0.7 x 0.9: 1 -0.65,0; 2 0.65,0
C0805 = smd 1.3 x 1.5: 1 -0.95,0; 2 0.95,0
SOT23-8 = smd 0.406 x 0.813: 1 -1,1.5; 2 -0.35,1.5; 3 0.3,1.5; 4 0.95,1.5; 5 0.95,3.8; 6 0.3,3.8; 7 -0.35,3.8; 8 -1,3.8
QFN64 = smd 0.7 x 0.25: 1 -14.56,5.02; 2 -14.56,4.52; 3 -14.56,4.02; 4 -14.56,3.52; 5 -14.56,3.02; 6 -14.56,2.52; 7 -14.56,2.02; 8 -14.56,1.52; 9 -14.56,1.02; 10 -14.56,0.52; 11 -14.56,0.02; 12 -14.56,-0.48; 13 -14.56,-0.98; 14 -14.56,-1.48; 15 -14.56,-1.98; 16 -14.56,-2.48; 33 -5.76,-2.48; 34 -5.76,-1.98; 35 -5.76,-1.48; 36 -5.76,-0.98; 37 -5.76,-0.48; 38 -5.76,0.02; 39 -5.76,0.52; 40 -5.76,1.02; 41 -5.76,1.52; 42 -5.76,2.02; 43 -5.76,2.52; 44 -5.76,3.02; 45 -5.76,3.52; 46 -5.76,4.02; 47 -5.76,4.52; 48 -5.76,5.02 | smd 0.25 x 0.7: 17 -13.91,-3.13; 18 -13.41,-3.13; 19 -12.91,-3.13; 20 -12.41,-3.13; 21 -11.91,-3.13; 22 -11.41,-3.13; 23 -10.91,-3.13; 24 -10.41,-3.13; 25 -9.91,-3.13; 26 -9.41,-3.13; 27 -8.91,-3.13; 28 -8.41,-3.13; 29 -7.91,-3.13; 30 -7.41,-3.13; 31 -6.91,-3.13; 32 -6.41,-3.13; 49 -6.41,5.67; 50 -6.91,5.67; 51 -7.41,5.67; 52 -7.91,5.67; 53 -8.41,5.67; 54 -8.91,5.67; 55 -9.41,5.67; 56 -9.91,5.67; 57 -10.41,5.67; 58 -10.91,5.67; 59 -11.41,5.67; 60 -11.91,5.67; 61 -12.41,5.67; 62 -12.91,5.67; 63 -13.41,5.67; 64 -13.91,5.67
SC70 = smd 0.35 x 0.8: 1 -0.65,-0.95; 2 0,-0.95; 3 0.65,-0.95; 4 0.65,0.95; 5 0,0.95; 6 -0.65,0.95
SOT23-5L = smd 0.55 x 1.2: 1 -0.95,-1.3; 2 0,-1.3; 3 0.95,-1.3; 4 0.95,1.3; 5 -0.95,1.3
SOT223 = smd 1.219 x 2.235: 1 -2.311,-3.099; 2 0,-3.099; 3 2.311,-3.099 | smd 3.6 x 2.2: 4 0,3.099
SOIC8 = smd 0.6 x 2.2: 1 -1.905,-2.6; 2 -0.635,-2.6; 3 0.635,-2.6; 4 1.905,-2.6; 5 1.905,2.6; 6 0.635,2.6; 7 -0.635,2.6; 8 -1.905,2.6
JP2 = drill 0.914 long: 1 -2.54,0; 2 0,0; 3 2.54,0
ST-5EW = smd 1.4 x 2: 1 -2.5,-2.6; 2 0,2.6; 3 2.5,-2.6
R0402 = smd 0.7 x 0.9: 1 -0.65,0; 2 0.65,0
TP = smd 3.81 x 2.032: TP 0,0
QSOP16 = smd 0.4 x 1: 1 -2.223,-2.75; 2 -1.588,-2.75; 3 -0.953,-2.75; 4 -0.318,-2.75; 5 0.318,-2.75; 6 0.953,-2.75; 7 1.588,-2.75; 8 2.223,-2.75; 9 2.223,2.75; 10 1.588,2.75; 11 0.953,2.75; 12 0.318,2.75; 13 -0.318,2.75; 14 -0.953,2.75; 15 -1.588,2.75; 16 -2.223,2.75
VHDCI68 = drill 1.2 pad 2.25: SHIELD0 18.375,-0.4; SHIELD1 -13.975,-0.4 | drill 0.65 pad 1: V1 -11.2,0.8; V2 -10.4,1.95; V3 -9.6,0.8; V4 -8.8,1.95; V5 -8,0.8; V6 -7.2,1.95; V7 -6.4,0.8; V8 -5.6,1.95; V9 -4.8,0.8; V10 -4,1.95; V11 -3.2,0.8; V12 -2.4,1.95; V13 -1.6,0.8; V14 -0.8,1.95; V15 0,0.8; V16 0.8,1.95; V17 1.6,0.8; V18 2.4,1.95; V19 3.2,0.8; V20 4,1.95; V21 4.8,0.8; V22 5.6,1.95; V23 6.4,0.8; V24 7.2,1.95; V25 8,0.8; V26 8.8,1.95; V27 9.6,0.8; V28 10.4,1.95; V29 11.2,0.8; V30 12,1.95; V31 12.8,0.8; V32 13.6,1.95; V33 14.4,0.8; V34 15.2,1.95; V35 -10.8,-1.55; V36 -10,-0.4; V37 -9.2,-1.55; V38 -8.4,-0.4; V39 -7.6,-1.55; V40 -6.8,-0.4; V41 -6,-1.55; V42 -5.2,-0.4; V43 -4.4,-1.55; V44 -3.6,-0.4; V45 -2.8,-1.55; V46 -2,-0.4; V47 -1.2,-1.55; V48 -0.4,-0.4; V49 0.4,-1.55; V50 1.2,-0.4; V51 2,-1.55; V52 2.8,-0.4; V53 3.6,-1.55; V54 4.4,-0.4; V55 5.2,-1.55; V56 6,-0.4; V57 6.8,-1.55; V58 7.6,-0.4; V59 8.4,-1.55; V60 9.2,-0.4; V61 10,-1.55; V62 10.8,-0.5; V63 11.6,-1.65; V64 12.4,-0.5; V65 13.2,-1.65; V66 14,-0.5; V67 14.8,-1.65; V68 15.6,-0.5 | hole 1.75: -18.75,-3.025; 23.15,-3.025
TQFN12 = smd 1 x 0.3: P$1 0.05,-1.1; P$2 0.05,-2; P$3 0.05,-2.9; P$7 3.95,-2.9; P$8 3.95,-2; P$9 3.95,-1.1 | smd 0.3 x 1: P$4 1.1,-3.95; P$5 2,-3.95; P$6 2.9,-3.95; P$10 2.9,-0.05; P$11 2,-0.05; P$12 1.1,-0.05 | smd 2 x 2: P$13 2,-2
MSOP10 = smd 0.25 x 1: 1 -1,-2.113; 2 -0.5,-2.113; 3 0,-2.113; 4 0.5,-2.113; 5 1,-2.113; 6 1,2.113; 7 0.5,2.113; 8 0,2.113; 9 -0.5,2.113; 10 -1,2.113

### Placement (x,y rotation side)
C1  8.89,26.62 90 top
C2  8.89,12.65 90 top
C3  8.89,43.13 90 top
C4  38.1,53.29 90 top
C5  76.2,46.99 90 top
C6  90.17,34.24 90 top
C7  67.31,50.8 90 top
C8  105.97,19 270 top
C9  92.71,34.24 90 top
C10  95.25,34.24 90 top
C11  72.39,29.16 270 top
C12  67.31,29.16 270 top
C13  69.85,29.16 270 top
C14  103.43,19.05 270 top
C15  98.35,16.51 270 top
C16  100.89,16.51 270 top
C17  94.54,24.13 270 top
C18  92,24.13 270 top
C19  58.42,22.86 270 top
C20  60.96,22.86 270 top
C21  63.5,19.05 270 top
C22  60.96,19.05 270 top
C23  63.5,29.21 180 top
C24  63.5,26.67 180 top
C25  49.53,53.29 90 top
C26  1.27,43.13 270 top
C27  1.27,26.62 270 top
C28  43.18,53.29 270 top
C29  54.61,53.29 90 top
C30  63.5,53.29 270 top
C31  58.42,53.29 90 top
C32  39.37,33.07 180 top
C33  39.37,17.83 180 top
C34  39.37,3.86 180 top
C35  1.27,12.65 270 top
CI1  12.7,35.51 270 top
CI2  12.7,20.27 270 top
CI3  12.7,8.84 270 top
IC1  81.43,21.69 270 top
IC2  20.32,35.51 270 top
IC3  20.32,20.27 270 top
IC4  21.59,8.84 270 top
IC5  5.08,43.13 0 top
IC6  5.08,27.89 0 top
IC7  5.08,12.65 0 top
IC8  40.64,53.29 0 top
IC9  20.32,53.29 0 bottom
IC10  68.58,46.94 180 top
IC11  33.02,53.29 0 bottom
IC12  33.02,34.24 270 top
IC13  72.39,46.94 180 top
IC14  33.02,20.27 270 top
IC15  33.02,7.57 270 top
IC16  52.07,53.29 0 top
IC17  60.96,53.29 0 top
JP1  82.55,57.1 0 top
JP2  7.62,55.83 90 top
R1  92.71,57.1 90 top
R2  72.39,57.1 90 top
R3  48.26,32.97 90 top
R4  5.08,35.51 0 top
R5  5.08,20.27 0 top
R6  5.08,5.03 0 top
R7  45.72,32.97 90 top
R8  12.7,52.02 90 bottom
R9  26.67,52.02 90 bottom
R10  39.37,35.51 0 top
R11  39.37,20.27 0 top
R12  39.37,6.3 0 top
R14  80.01,15.19 270 top
R15  80.01,19 270 top
R16  82.55,15.19 270 top
R17  82.55,19 270 top
R18  85.09,15.19 270 top
R19  85.09,19 270 top
R20  87.63,15.19 270 top
R21  87.63,19 270 top
R22  90.17,15.19 270 top
R23  90.17,19 270 top
R24  92.71,15.19 270 top
R25  92.71,19 270 top
R26  86.36,15.19 270 bottom
R27  86.36,19 270 bottom
R28  83.82,15.19 270 bottom
R29  83.82,19 270 bottom
R30  81.28,15.19 270 bottom
R31  81.28,19 270 bottom
R32  74.93,15.19 270 top
R33  74.93,19 270 top
R34  78.74,15.19 270 bottom
R35  78.74,19 270 bottom
R36  77.47,15.19 270 top
R37  77.47,19 270 top
R38  76.2,15.19 270 bottom
R39  76.2,19 270 bottom
R40  91.44,15.19 270 bottom
R41  91.44,19 270 bottom
R42  88.9,15.19 270 bottom
R43  88.9,19 270 bottom
TP1  26.67,48.21 90 bottom
TP2  26.67,55.83 270 bottom
TP3  12.7,48.21 270 bottom
TP4  12.7,55.83 270 bottom
TP5  39.37,55.83 90 bottom
TP6  16.51,43.13 180 bottom
TP7  92.71,41.86 0 top
TP8  67.31,41.86 0 top
TP9  100.89,31.7 0 top
TP10  99.06,35.51 0 top
TP11  25.4,34.24 180 top
TP12  44.45,27.89 0 top
TP13  21.59,15.19 180 top
TP14  41.4,24.99 0 top
TP15  39.57,44.86 0 top
TP16  50.8,45.67 0 top
TP17  60.96,45.67 0 top
TP18  41.5,10.26 0 top
TP19  71.12,35.51 0 top
TP20  58.42,12.65 0 top
TP21  66.04,12.65 0 top
TP22  60.96,35.51 0 top
TP23  52.07,35.51 0 top
TP24  16.26,40.84 0 top
TP25  22.61,25.86 0 top
TP26  22.61,1.98 0 top
TP27  86.11,50.5 0 top
TP28  78.49,50.75 0 top
U$1  49.53,15.19 270 top
U$2  81.28,7.57 0 top
U$3  98.35,25.35 0 top
U$4  54.61,8.84 270 top
U$5  68.58,25.35 270 top

### Tracks (layer width: path | path; a pad name or v marks a point on that pad's centre or on a via)
!CS_ADC1  (1 unrouted)
  Top 0.203: U$3.P$9 104.38,24.25 107.7,20.93 107.7,15.65 103.63,11.58 98.96,11.58 98.15,10.77
!CS_ADC2  (1 unrouted)
  Top 0.203: U$5.P$9 70.04,21.4 72.95,18.49 72.95,13.21 74.57,11.58
!CS_DAC
  Top 0.203: U$4.7 79.65,8.34 U$2.V13
AGND  (via drill 0.6)  (3 unrouted)
  Top 0.203: R3.2 R7.2 | C6.2 92.41,35.19 C9.2 C10.2 | IC1.48 IC1.49 | IC1.1 IC1.64 86.61,35.6 85.75,34.75 85.75,33.33 86.36,32.72 86.99,32.72 IC1.58 | IC1.17 IC1.16 78.76,36.25 72.54,42.47 72.54,48.09 IC13.2 | IC1.32 IC1.33
  Top 0.406: v47.35,37.59 47.35,34.53 R3.2 | 72.54,42.47 v75.59,42.47 | IC1.64 89.76,35.6 C6.2
  Route2 0.406: v47.35,37.59 47.35,38 50.39,41.05 74.17,41.05 v75.59,42.47
AVDD  (via drill 0.6)
  Top 0.203: IC1.62 87.93,34.6 89.2,33.33 90.13,33.33 C6.1 90.47,33.59 C9.1 C10.1 95.31,33.53 95.71,33.53 96.32,34.14 96.32,36.58 92.71,40.18 TP7.TP
  Top 0.406: IC13.5 73.34,45.13 74.37,44.09 v79.05,44.09 | v88.59,44.09 90.47,44.09 TP7.TP
  Route3 0.406: v79.05,44.09 v88.59,44.09
BASELINE
  Top 0.203: IC1.56 94.8,31.6 95.71,32.51 98.15,32.51 99.16,33.53 99.16,35.41 TP10.TP
CAP_PRECHAR  (via drill 0.6)
  Top 0.203: U$1.12 53.2,14.87 53.85,14.22 62.38,14.22 63.4,13.21 65.48,13.21 TP21.TP 69.04,12.65 v69.09,12.6 | IC1.14 79.95,37.09 78.64,38.41 78.64,39.22 v80.26,40.84
  Bottom 0.203: v80.26,40.84 79.65,40.84 75.18,36.37 75.18,31.9 72.95,29.67 71.12,29.67 68.07,26.62 68.07,15.85 69.29,14.63 69.29,12.8 v69.09,12.6
CLK  (via drill 0.6)
  Top 0.203: IC1.20 77.25,34.1 v76.4,34.95
  Bottom 0.203: R30.1 R31.2 81.75,18.35 82.5,19.1 82.5,28.65 81.89,29.26 81.89,31.7 80.06,33.53 79.65,33.53 79.05,34.14 77.22,34.14 v76.4,34.95
CLK_ADC  (2 unrouted)
  Top 0.203: U$3.P$10 104.14,25.3 108.31,21.13 108.31,15.44 103.83,10.97 99.97,10.97 97.94,8.94 | U$5.P$10 69.6,22.45 73.36,18.69 73.36,13.41 74.78,11.99
CLK_DAC
  Top 0.203: U$4.10 69.17,9.84 69.7,10.36 78.04,10.36 U$2.V12
CLK_PRECH1  (via drill 0.6)
  Top 0.203: v84.12,34.54 83.31,34.54 82.5,35.36 82.5,36.2 IC1.9
  Bottom 0.203: R40.1 R41.2 90.97,18.35 90.22,19.1 90.22,20.12 86.16,24.18 86.16,31.7 84.12,33.73 v84.12,34.54
CLK_PRECH1_T  (1 unrouted)
CLK_PRECH2  (via drill 0.6)
  Top 0.203: v82.5,38.61 82.5,38.2 81.89,37.59 81.89,36.31 IC1.10
  Bottom 0.203: R42.1 R43.2 88.53,18.35 87.78,19.1 87.78,20.73 85.75,22.76 85.75,31.09 82.09,34.75 82.09,38.2 v82.5,38.61
CLK_PRECH2_T  (1 unrouted)
CLK_REF  (via drill 0.6)
  Top 0.203: v13.21,5.49 14.2,6.48 CI3.4 14.6,7.89 15.04,8.33 15.04,18.9 | 15.04,18.9 15.04,33.72 CI1.4 | CI2.4 14.62,19.32 15.04,18.9
  Bottom 0.203: v13.21,5.49 13.41,5.49 14.22,4.67 16.05,4.67 16.66,5.28 24.79,5.28 25.4,4.67 25.4,1.83 27.43,-0.2 71.73,-0.2 75.18,3.25 91.44,3.25 92.86,4.67 92.86,5.9 U$2.V63
CLK_T  (1 unrouted)
CS_B0
  Top 0.203: R15.2 R14.1 80.01,17.02 81.18,18.19 81.28,18.29 81.28,21.13 82.91,22.76 82.91,27.41 IC1.41
CS_B0_T  (1 unrouted)
CS_B1
  Top 0.203: R17.2 R16.1 82.55,16.51 83.52,17.48 83.52,27.39 IC1.42
CS_B1_T  (1 unrouted)
CS_B2
  Top 0.203: R19.2 R18.1 85.09,16.71 84.12,17.68 84.12,27.28 IC1.43
CS_B2_T  (1 unrouted)
CS_B3
  Top 0.203: R21.2 R20.1 87.63,16.82 86.36,18.09 86.36,23.77 84.53,25.6 84.53,27.37 IC1.44
CS_B3_T  (1 unrouted)
CS_B4
  Top 0.203: R23.2 R22.1 90.17,16.92 89,18.09 89,21.74 84.94,25.81 84.94,27.44 IC1.45
CS_B4_T  (1 unrouted)
CS_B5
  Top 0.203: R25.2 R24.1 92.71,17.02 91.44,18.29 91.44,20.12 85.55,26.01 85.55,27.36 IC1.46
CS_B5_T  (1 unrouted)
CS_REF_1  (via drill 0.6)  (1 unrouted)
  Top 0.203: CI1.6 17.42,35.21 17.48,35.15 17.48,33.12 16.87,32.51 16.87,29.26 v17.07,29.06
  Bottom 0.203: v17.07,29.06 26.21,29.06 27.84,27.43 27.84,3.25 28.85,2.23 71.12,2.23
CS_REF_2  (via drill 0.6)  (1 unrouted)
  Top 0.203: CI2.6 17.22,19.97 17.48,19.71 17.48,17.07 v16.87,16.46
  Bottom 0.203: v16.87,16.46 17.27,16.66 19.3,16.66 20.52,15.44 25.4,15.44 27.03,13.82 27.03,2.64 28.25,1.42 71.12,1.42
CS_REF_3  (via drill 0.6)  (1 unrouted)
  Top 0.203: CI3.6 17.47,8.54 17.88,8.13 17.88,7.11 v17.48,6.71
  Bottom 0.203: v17.48,6.71 25.6,6.71 26.21,6.1 26.21,2.23 27.84,0.61 71.12,0.61
DGND  (via drill 0.6)
  Top 0.203: R3.1 48.35,32.41 49.28,32.41 51.61,30.07 62.99,30.07 64.41,31.5 65.38,31.5 v65.53,31.34 65.53,29.77 66.85,28.45 67.25,28.45 C12.2 | v70.51,49.58 68.89,49.58 68.68,49.38 68.68,48.34 IC10.2 | C11.2 74.74,28.21 76.61,30.07 78.27,30.07 IC1.28
  Top 0.406: C11.2 72.09,28.51 C13.2 C12.2
  Route3 0.203: v65.53,31.34 65.53,39.12 70.71,44.3 70.71,49.38 v70.51,49.58
DVDD  (via drill 0.6)
  Top 0.203: 70.15,30.11 C13.1 | v68.48,31.5 68.48,30.42 67.87,29.81 | v68.48,37.19 67.31,38.35 TP8.TP 67.31,42.11 69.49,44.3 69.49,45.6 IC10.5 | C11.1 76.03,30.11 76.61,30.68 78.22,30.68 IC1.27
  Top 0.406: C11.1 70.15,30.11 | C13.1 67.87,29.81 C12.1
  Route3 0.203: v68.48,37.19 v68.48,31.5
GND  (via drill 0.6)  (8 unrouted)
  Top 0.203: R4.3 8.2,33.53 9.96,33.53 11.64,35.21 CI1.3 14.26,35.15 15.04,35.15 15.24,35.36 15.24,35.97 15.78,36.51 CI1.8 17.54,36.51 18.49,35.56 19.32,35.56 IC2.2 19.96,35.51 20.32,35.15 20.32,33.12 21.13,32.31 30.39,32.31 IC12.4 32.28,32.33 33.53,31.09 38.11,31.09 38.72,31.7 | IC5.2 5.08,40.84 4.27,40.03 | 4.27,40.03 3.66,39.42 3.66,35.76 5.69,33.73 7.11,33.73 7.58,33.26 R4.3 | R4.3 7.58,28.58 C1.2 | IC6.2 5.08,25.4 4.67,24.99 4.06,24.99 3.09,25.97 C27.2 1.27,24.13 3.25,22.15 3.25,20.52 4.88,18.9 5.08,18.9 | 5.08,18.9 7.32,18.9 7.52,18.69 7.52,18.29 | 7.52,18.29 7.52,17.73 R5.3 7.58,14.61 C2.2 | JP2.1 7.62,45.05 C3.2 | C26.2 1.27,41 2.23,40.03 | 2.23,40.03 4.27,40.03 | 2.23,40.03 1.63,39.42 1.63,38.81 v1.83,38.61 | C35.2 1.27,10.92 2.64,9.55 4.27,9.55 | 4.27,9.55 4.67,9.55 4.88,9.75 4.88,10.36 | 4.88,10.36 4.88,11.15 IC7.2 | R6.3 6.11,2.43 3.25,5.28 3.25,8.33 | 3.25,8.33 3.25,8.53 4.27,9.55 | 3.25,8.33 v1.83,8.33 | v5.08,17.48 5.08,18.9 | CI2.3 9.2,19.97 7.52,18.29 | IC3.2 19.32,20.32 18.49,20.32 17.54,21.27 CI2.8 16.5,25.64 v17.07,26.21 | 56.08,53.94 C29.2 54.35,53.94 53.65,53.24 53.65,50.8 53.44,50.6 52.22,50.6 52.02,50.8 52.02,51.94 IC16.2 | 56.08,53.94 C31.2 58.52,54.04 58.52,55.07 58.73,55.47 60.55,55.47 60.96,55.07 IC17.2 60.96,49.38 61.77,48.56 64.01,48.56 64.62,49.17 64.62,51.52 | 64.62,51.52 C30.2 64.83,52.64 66.65,54.46 66.65,58.32 68.28,59.94 74.64,59.94 R2.3 | C4.2 37.48,53.94 36.98,53.44 36.98,51.21 37.59,50.6 38.81,50.6 | 38.81,50.6 40.23,50.6 40.64,51 IC8.2 | C28.2 45.93,52.64 46.74,53.44 | 46.74,53.44 47.14,53.85 49.38,53.85 | 49.38,53.85 49.44,53.85 C25.2 49.53,53.9 49.58,53.85 49.58,53.65 49.38,53.85
  Top 0.203: 38.81,50.6 38.81,49.78 v41.1,48.77 | CI3.3 10.37,8.54 9.96,8.13 7.52,8.13 6.3,9.35 5.89,9.35 4.88,10.36 | IC4.2 20.54,8.94 19.71,8.94 18.81,9.84 CI3.8 16.5,9.92 16.05,10.36 16.05,11.99 v17.07,13.01 | C19.2 C20.2 64.39,22.21 U$5.P$6 | C19.2 58.42,22.15 | C21.2 C22.2 59.83,18.4 58.52,19.71 58.52,20.52 | 62.85,27.64 C24.2 62.85,26.15 63.4,25.6 65.38,25.6 U$5.P$3 | 62.85,27.64 C23.2 | C17.2 C18.2 | C15.2 C16.2 | C14.2 105.92,18.4 C8.2 | 58.52,20.52 58.52,22.11 C19.2 | C5.2 75.79,48.05 75.79,49.58 73.92,51.45 C7.2 67.24,51.52 64.62,51.52 | U$4.3 48.87,8.84 47.14,10.57 47.14,12.6 U$1.8 45.68,12.97 45.68,10.32 44.81,9.45 | R7.1 43.88,32.32 42.88,33.33 v42.88,36.37 42.27,36.98 39.01,36.98 38.72,36.69 R10.1 | 44.81,9.45 43.89,8.53 39.53,8.53 38.72,7.72 | v55.47,21.13 57.91,21.13 58.52,20.52 | v59.94,27.03 62.24,27.03 62.85,27.64 | C33.2 38.72,16.16 36.78,14.22 v35.15,14.22 | v45.72,55.88 45.72,54.46 46.74,53.44 | v56.49,50.6 56.49,53.53 56.08,53.94 | C34.2 38.72,3.14 39.22,2.64 44.7,2.64 46.33,4.27 46.33,7.92 44.81,9.45
  Top 0.406: C32.2 38.72,31.7 R11.1 | C33.2 38.72,7.72 R12.1 | U$3.P$3 97.73,22.45 v96.83,21.54 95.81,20.52
  Route2 0.203: 2.23,37.59 2.85,37.59 | 1.63,7.52 1.63,8.13 1.42,8.33 | v41.1,48.77 42.27,48.77 | v22.35,47.14 23.16,47.14
  Bottom 0.406: IC11.2 33.02,48.67 v33.93,47.75 | IC9.2 20.32,48.16 21.34,47.14 v22.35,47.14
  pour Route2 (isolate 0.254): 0,60.96 0,0 109.02,0.2 109.02,61.57
  pour Top: 108.92,26.82 61.16,26.82 61.16,0.81 108.92,0.81
HOLD  (via drill 0.6)
  Top 0.203: IC1.37 80.95,25.48 v80.26,24.79
  Bottom 0.203: R38.1 R39.2 77.07,18.35 77.62,18.9 77.62,22.15 v80.26,24.79
HOLD_T  (1 unrouted)
MUX_DAC_EN  (via drill 0.6)  (1 unrouted)
  Top 0.203: v54.66,16.87 52.37,16.87 U$1.15
  Bottom 0.203: v54.66,16.87 54.66,15.44 53.65,14.43 53.65,6.1 56.29,3.45 71.12,3.45
MUX_DAC_SEL  (via drill 0.6)  (1 unrouted)
  Top 0.203: U$1.1 46.78,20.36 v46.94,20.52
  Bottom 0.203: v46.94,20.52 51.21,20.52 53.24,18.49 53.24,5.69 55.88,3.05 71.12,3.05
MUX_REF_1  (via drill 0.6)  (1 unrouted)
  Top 0.203: IC2.6 21.93,36.16 22.96,37.19 v22.96,38
  Bottom 0.203: 71.32,2.85 71.12,2.64 29.26,2.64 28.25,3.66 28.25,36.78 27.03,38 v22.96,38
MUX_REF_2  (via drill 0.6)  (1 unrouted)
  Top 0.203: IC3.6 22.14,20.92 22.14,21.73 v22.76,22.35
  Bottom 0.203: v22.76,22.35 22.96,22.35 23.57,21.54 26.21,21.54 27.43,20.32 27.43,2.85 28.45,1.83 71.12,1.83
MUX_REF_3  (via drill 0.6)  (1 unrouted)
  Top 0.203: IC4.6 22.54,11.19 v22.35,11.38
  Bottom 0.203: v22.35,11.38 25.6,11.38 26.62,10.36 26.62,2.44 28.04,1.02 71.12,1.02
N$5  (via drill 0.6)
  Top 0.203: v13.41,10.97 13.41,9.96 13.61,9.75 14.02,9.75 CI3.1 | v17.07,10.97 18.49,10.97 19.91,9.55 IC4.1
  Bottom 0.203: v17.07,10.97 v13.41,10.97
N$17
  Top 0.203: IC2.1 18.7,36.16 17.68,37.19 14.88,37.19 CI1.1
N$19  (via drill 0.6)
  Top 0.203: CI2.1 14.2,23.59 13.82,23.98 v13.82,24.18 | IC3.1 19.37,22.29 18.69,22.96 v18.69,24.18
  Bottom 0.203: v18.69,24.18 v13.82,24.18
OP_MODE  (via drill 0.6)
  Top 0.203: v80.87,34.75 81.48,35.36 81.48,36.22 IC1.11
  Bottom 0.203: R26.1 R27.2 85.69,18.35 85.34,18.69 85.34,30.89 81.48,34.75 v80.87,34.75
OP_MODE_T  (1 unrouted)
OUT_S
  Top 0.203: R33.2 74.93,16.87 | 74.93,16.87 R32.1 | IC1.35 79.86,27.45 79.86,26.42 76.2,22.76 76.2,18.14 74.93,16.87
OUT_S_T  (1 unrouted)
POT_R1
  Top 0.203: R1.3 92.81,57.1 R1.2 JP1.3 85.09,51.51 TP27.TP 86.67,50.49 86.36,50.8
POT_R2
  Top 0.203: R2.2 75.79,57.1 | 75.79,57.1 JP1.1 | 75.79,57.1 74.99,56.3 R2.1 76.87,54.6 78.44,53.03 78.44,50.8 TP28.TP
POT_R4  (via drill 0.6)
  Top 0.203: R4.2 9.64,38.11 v9.75,38 12.6,40.84 TP24.TP | IC2.3 19.37,34 19.3,33.93 v19.3,33.53
  Bottom 0.203: v9.75,38 11.58,38 16.05,33.53 v19.3,33.53
POT_R5  (via drill 0.6)
  Top 0.203: R5.2 5.08,21.34 5.89,20.52 v7.11,20.52 | v20.12,17.48 20.12,18.9 IC3.3 19.82,19.62 20.32,20.12 20.32,23.57 TP25.TP
  Bottom 0.203: v20.12,17.48 16.87,20.52 v7.11,20.52
POT_R6
  Top 0.203: R6.2 7.2,7.63 11.99,2.85 21.34,2.85 22.45,1.73 | 22.45,1.73 22.76,1.42 | IC4.3 22.61,6.22 TP26.TP 22.61,1.88 22.45,1.73
REF_ADC  (via drill 0.6)
  Top 0.203: IC17.5 59.74,54.32 59.74,53.44 58.94,52.64 C31.1 58.42,48.21 TP17.TP 60.96,44.7 62.59,43.08 v63.4,43.08 | C23.1 C24.1 65.99,26.67 66.04,26.62 | C18.1 93.57,24.78 | 93.57,24.78 C17.1 95.41,24.78 96.83,23.37 98.38,23.37 U$3.P$2 | 66.45,25.43 66.45,26.21 66.04,26.62 | 66.45,25.43 U$5.P$2 66.55,25.3 66.45,25.4 66.45,25.43 | 93.57,24.78 v93.57,27.23 | 66.04,26.62 66.04,27.43 65.94,27.53 65.94,27.94 v65.84,28.04
  Route3 0.203: v93.57,27.23 93.17,26.82 93.17,26.62 92.96,26.42 67.06,26.42 65.84,27.64 v65.84,28.04 65.84,28.25 63.6,30.28 63.4,30.48 v63.4,43.08
REFIN_DAC  (via drill 0.6)
  Top 0.203: IC8.5 38.81,55.47 36.58,55.47 36.37,55.27 36.37,50.19 38.61,47.95 38.61,45.31 39.01,45.31 TP15.TP 39.57,42.22 v39.42,42.06 | U$4.6 56.72,6.27 v57.3,5.69
  Route3 0.203: v39.42,42.06 39.42,15.85 46.74,8.53 52.83,8.53 55.88,5.49 57.1,5.49 v57.3,5.69
RES_BIAS_EXT
  Top 0.203: JP1.2 82.55,42.42 83.92,41.05 83.92,36.28 IC1.6
RST
  Top 0.203: R36.1 77.47,17.07 | 77.47,17.07 R37.2 | IC1.38 81.45,23.13 78.84,20.52 78.84,18.44 77.47,17.07
RST_CSA  (via drill 0.6)
  Top 0.203: v80.06,38.61 80.06,38.41 80.87,37.59 80.87,36.33 IC1.12
  Bottom 0.203: R28.1 R29.2 84.39,18.35 84.73,18.69 84.73,29.46 79.86,34.34 79.86,38.41 v80.06,38.61
RST_CSA_T  (1 unrouted)
RST_T  (1 unrouted)
SDI_DAC
  Top 0.203: U$4.9 69.08,9.34 69.7,9.96 76.84,9.96 U$2.V10
SDI_REF  (via drill 0.6)
  Top 0.203: CI1.5 15.87,34.56 15.65,34.34 15.65,19.51 15.85,19.3 16.48,19.3 CI2.5 16.5,18.94 15.65,18.09 15.65,8.13 15.85,7.92 16.46,7.92 CI3.5 16.22,7.89 15.44,7.11 v15.44,6.1
  Bottom 0.203: v15.44,6.1 16.05,6.1 16.46,5.69 18.29,5.69 18.9,6.3 25.2,6.3 25.81,5.69 25.81,2.03 27.64,0.2 71.53,0.2 74.98,3.66 91.24,3.66 92.08,4.5 U$2.V62
SDO_ADC1  (1 unrouted)
  Top 0.203: U$3.P$8 104.46,23.35 107.09,20.73 107.09,15.85 103.43,12.19 98.35,12.19
SDO_ADC2  (1 unrouted)
  Top 0.203: U$5.P$8 66.58,20.39 67.26,19.71 71.12,19.71 72.54,18.29 72.54,13.01 73.97,11.58
SGN  (via drill 0.6)
  Top 0.203: v80.06,31.7 80.87,31.7 81.89,30.68 81.89,27.51 IC1.39
  Bottom 0.203: R35.2 R34.1 78.74,16.36 80.06,17.68 80.06,22.55 81.89,24.38 81.89,29.87 v80.06,31.7
SGN_T  (1 unrouted)
V0NDAC  (via drill 0.6)
  Top 0.203: U$1.5 43.12,14.87 v42.27,14.02 | v50.6,10.16 50.8,10.16 51.61,9.35 52.49,9.35 U$4.2
  Bottom 0.406: v42.27,14.02 42.88,14.02 47.14,9.75 50.19,9.75 v50.6,10.16
V0PDAC  (via drill 0.6)
  Top 0.203: U$1.2 45.81,16.78 45.11,17.48 v45.11,19.51 | U$4.1 52.5,10.29 51.21,11.58 v48.56,11.58
  Bottom 0.203: v45.11,19.51 45.11,16.05 48.56,12.6 v48.56,11.58
V1NDAC  (via drill 0.6)
  Top 0.203: U$1.14 53.15,16.14 53.85,15.44 56.08,15.44 57.1,16.46 v57.1,17.48 | U$4.5 53.76,7.84 v54.66,6.91
  Bottom 0.203: v57.1,17.48 57.1,17.27 54.05,14.22 54.05,7.52 v54.66,6.91
V1PDAC  (via drill 0.6)
  Top 0.203: U$4.4 54.26,8.34 v55.07,9.14 | U$1.11 53.02,14.24 54.66,12.6 54.86,12.6 v55.07,12.39
  Bottom 0.203: v55.07,9.14 54.86,9.35 54.86,12.19 v55.07,12.39
V_REF_PRECHAR  (via drill 0.6)
  Top 0.203: IC15.2 32.84,8.2 34.14,6.91 35.59,6.91 IC15.6 | 40.02,5.28 40.27,5.03 43.74,5.03 v44.09,4.67 | IC1.7 83.45,40.7 v81.28,42.88
  Top 0.406: R12.2 40.02,5.28 40.02,4.88 | 40.02,4.88 C34.1 | IC15.6 36.96,6.93 37.39,6.5 37.39,5.28 37.59,5.08 39.82,5.08 40.02,4.88
  Route2 0.203: v44.09,4.67 44.09,9.35 40.03,13.41 40.03,36.98 45.11,42.06 72.14,42.06 73.76,43.69 77.83,43.69 79.05,42.47 80.87,42.47 v81.28,42.88
VCC  (3 unrouted)
VDD  (via drill 0.6)
  Top 0.203: CI1.2 13.31,35.86 13.21,35.97 13.21,36.98 13.82,37.59 19.51,37.59 20.32,36.78 | 20.32,36.78 20.32,35.97 20.73,35.56 21.22,35.56 IC2.5 | 20.32,36.78 v20.32,38.86 | v11.43,41.86 10.81,42.48 C3.1 7.32,42.47 6.68,41.83 IC5.3 IC5.4 | IC6.4 IC6.3 7.14,26.59 7.72,26.01 8.85,26.01 C1.1 10.4,25.97 v10.77,25.6 12.6,23.77 12.6,21.13 13.11,20.62 CI2.2 | IC7.4 IC7.3 8.24,11.35 C2.1 8.89,9.7 v8.74,9.55 9.1,9.19 CI3.2 14.07,9.19 14.02,9.14 14.22,9.14 | IC8.4 41.59,53.24 | 41.59,53.24 IC8.3 41.89,51.99 42.47,51.41 45.72,51.41 | 45.72,51.41 48.3,51.41 C25.1 50,52.64 50.6,53.24 52.63,53.24 53.03,52.83 53.03,52 IC16.3 IC16.4 53.02,54.65 54.25,55.88 60.96,55.88 61.77,55.07 61.77,54.73 IC17.4 62.85,54.59 C30.1 62.88,53.94 62.38,53.44 62.38,52.46 IC17.3 | C4.1 38.41,52.64 39.01,53.24 41.59,53.24 | v46.53,50.19 46.33,50.19 46.13,50.39 46.13,51 45.72,51.41 | R1.1 95.31,53.03 96.11,52.22 97.94,52.22 v97.94,51.82 | IC3.5 24.33,20.27 25.81,21.74 v25.81,22.55 | v20.12,11.38 20.52,11.38 21.54,10.36 21.54,9.14 21.95,8.74 22.44,8.74 IC4.5 | v98.04,19.71 98.35,19.41 C15.1 C16.1 | U$5.P$4 61.7,24.25 C20.1 C19.1 58.42,24.08 v57.1,25.4 | v49.58,18.69 50.86,17.41 U$1.16 | U$4.8 58.62,8.84 v58.73,8.94
  Top 0.406: U$3.P$4 99.45,21.11 v98.04,19.71
  Route3 0.203: 10.77,23.98 10.77,23.16 | v42.52,57.51 42.27,51.21 | v97.94,51.82 98.75,51.82
  Bottom 0.203: 39.42,55.78 39.42,54.25
  Bottom 0.406: IC11.3 30.71,47.32 31.5,46.53 37.8,46.53 39.42,48.16 39.42,55.78 TP5.TP | 39.42,54.25 v42.52,57.51
  pour Route3 (isolate 0.254): 0,60.96 109.02,61.16 109.02,0 0,0
VDD2  (via drill 0.6)
  Top 0.203: 67.63,47.48 IC10.3 67.46,48.41 67.46,50.19 67.35,50.19 C7.1 | 67.56,45.52 IC10.4 | C5.1 75.58,46.34 74.57,47.35 74.57,49.17 73.97,49.78 71.93,49.78 71.53,49.38 71.53,48.33 IC13.3
  Top 0.406: IC10.4 IC10.3 | IC13.4 71.44,46.94 | 71.44,46.94 IC13.3 | 67.63,47.48 68.17,46.94 71.44,46.94 | 67.56,45.52 v66.14,45.52
  Bottom 0.406: IC9.3 18.01,48.03 20.32,45.72 20.93,45.72 | 20.93,45.72 65.73,45.72 65.94,45.52 v66.14,45.52 | TP6.TP 19.56,43.13 20.93,44.5 20.93,45.72
VDD_REF_1  (via drill 0.6)
  Top 0.203: IC5.5 3.48,43.78 C26.1 0.5,43.78 0.41,43.69 0.41,34.34 0.81,33.93 1.55,33.93 R4.1 3.67,32.91 4.27,32.31 v4.88,32.31 | CI1.7 17.58,35.86 18.09,35.36 v18.09,31.7
  Bottom 0.203: v4.88,32.31 5.69,31.5 17.48,31.5 17.68,31.7 v18.09,31.7
VDD_REF_2  (via drill 0.6)
  Top 0.203: IC6.5 3.19,29.19 C27.1 1.23,27.23 0.41,27.23 0.41,23.77 2.58,21.6 R5.1 2.58,15.99 v1.42,15.24 | CI2.7 17.58,20.62 18.09,20.12 18.09,16.66 18.69,16.05 v18.69,15.24
  Bottom 0.203: v1.42,15.24 v18.69,15.24
VDD_REF_3  (via drill 0.6)
  Top 0.203: 1.42,3.05 0.41,4.06 0.41,13.21 0.5,13.3 C35.1 2.73,13.3 3.25,13.82 4,13.82 IC7.5 4.2,13.95 4.27,14.02 | 1.42,3.05 2.03,2.44 R6.1 | CI3.7 17.63,9.19 18.49,8.33 18.49,4.47 v18.29,4.06 | v16.46,1.63 16.46,0.81 16.05,0.41 1.83,0.41 1.42,0.81 1.42,3.05
  Bottom 0.203: v18.29,4.06 18.29,3.66 16.46,3.25 v16.46,1.63
VDD_SUPPLY_1
  Bottom 0.203: 35.15,50.37 IC11.1
  Bottom 0.406: TP1.TP R9.1 27.8,51.37 28.85,52.43 28.85,53.65 29.46,54.25 34.54,54.25 35.15,53.65 35.15,50.37
VDD_SUPPLY_2
  Bottom 0.203: TP3.TP R8.1 | 22.55,50.27 IC9.1
  Bottom 0.406: R8.1 12.7,49.84 12.8,49.73 13.97,49.73 14.43,50.19 14.43,53.24 15.24,54.05 21.74,54.05 22.55,53.24 22.55,50.27
VDD_SUPPLY_IN_1  (via drill 0.6)
  Top 0.406: IC12.7 37.11,34.87 37.39,35.15 37.39,37.8 v36.58,37.8 | IC15.7 37.47,8.2 38,8.74 38,10.97 37.8,11.18 v36.78,11.18 | IC14.7 37.16,20.9 37.8,21.54 37.8,23.77 v36.78,23.77
  Route3 0.406: v24.79,51.41 24.79,48.16 28.45,44.5 31.9,44.5 33.12,43.28 33.12,39.01 | 33.12,39.01 33.12,25.2 | 33.12,25.2 33.12,11.99 35.97,11.99 v36.78,11.18 | v36.58,37.8 34.34,37.8 33.12,39.01 | 33.12,25.2 35.36,25.2 v36.78,23.77
  Bottom 0.406: JP2.3 24.13,58.37 TP2.TP R9.2 26.05,52.67 v24.79,51.41
VDD_SUPPLY_IN_2
  Bottom 0.406: JP2.2 TP4.TP R8.2
VI+_FIL  (via drill 0.6)
  Top 0.203: U$1.4 46.72,15.44 44.09,15.44 | 44.09,15.44 42.06,15.44 40.84,14.22 40.84,10.92 TP18.TP | v42.47,17.48 42.47,17.07 44.09,15.44 | v72.14,33.93 74.98,33.93 75.79,33.12 78.28,33.12 IC1.22
  Bottom 0.203: v72.14,33.93 56.69,33.93 42.47,19.71 v42.47,17.48
VI-_FIL  (via drill 0.6)
  Top 0.203: IC1.23 72.25,32.6 70.71,34.14 70.71,34.75 70.71,35.1 | 70.71,35.1 TP19.TP | U$1.7 50.2,13.6 53.24,10.57 62.79,10.57 v62.99,10.77 | 70.71,35.1 70.71,36.78 v72.95,39.01
  Bottom 0.203: v72.95,39.01 72.95,37.8 73.76,36.98 73.76,32.51 72.95,31.7 70.51,31.7 60.76,21.95 60.76,11.79 61.77,10.77 v62.99,10.77
VICM  (via drill 0.6)
  Top 0.203: IC12.2 32.38,34.87 33.53,33.73 35.49,33.73 | C32.1 40.02,32.32 TP12.TP 47.7,27.89 48.16,27.43 48.16,16.66 | 48.16,16.66 49.17,15.65 49.78,15.65 | 49.78,15.65 52.14,15.65 U$1.13 53.17,15.51 53.85,14.83 56.69,14.83 58.73,16.87 62.99,16.87 v63.6,16.26 | 48.16,16.66 48.16,16.46 47.95,16.26 46.89,16.26 U$1.3 | U$1.6 49.19,14.24 49.68,14.73 | 49.68,14.73 49.78,14.83 49.78,15.65 | U$1.10 50.81,13.6 49.68,14.73 | IC1.40 82.45,28.6 v83.11,29.26
  Top 0.406: C32.1 40.02,34.54 | 40.02,34.54 R10.2 | 40.02,34.54 39.82,34.34 38,34.34 37.26,33.6 IC12.6 35.49,33.73
  Route2 0.203: v83.11,29.26 83.31,29.06 83.31,22.96 82.7,22.35 74.17,22.35 68.07,16.26 v63.6,16.26
VICM_MUX
  Top 0.203: IC2.4 24.78,34.86 TP11.TP 27.94,34.24 28.45,33.73 30.29,33.73 IC12.3
VIN_CSA  (via drill 0.6)
  Top 0.203: U$1.9 52.28,12.54 53.44,11.38 57.15,11.38 TP20.TP 61.92,12.65 v61.98,12.6 | IC1.15 79.45,36.78 77.42,38.81 77.42,41.66 v77.83,42.06
  Bottom 0.203: v77.83,42.06 77.83,40.44 74.37,36.98 74.37,31.9 73.56,31.09 71.32,31.09 61.98,21.74 v61.98,12.6
VL_ADC  (via drill 0.6)
  Top 0.203: U$3.P$7 102.3,20.1 | 102.3,20.1 v101.91,19.3 | U$5.P$7 65.68,19.76 v65.43,19.71 65.62,19.7 C21.1 C22.1 | C8.1 105.92,19.7 C14.1 102.7,19.7 102.3,20.1 | TP16.TP 54.81,45.67 v55.07,45.92 54.61,46.38 C29.1 | IC16.5 51.12,57.39 v51,57.51
  Route3 0.203: v101.91,19.3 99.06,17.07 69.9,17.07 67.26,19.71 v65.43,19.71 64.01,19.71 62.18,21.54 62.18,36.58 57.51,41.25 57.51,45.11 | 57.51,45.11 57.51,46.33 54.46,49.38 54.46,56.9 54.05,57.3 51.21,57.3 v51,57.51 | v55.07,45.92 56.69,45.92 57.51,45.11
VO+_BP_FIL
  Top 0.203: IC1.24 70.92,32.1 69.29,33.73 62.74,33.73 TP22.TP
VO+_CH
  Top 0.203: U$3.P$12 99.47,25.32 99.47,26.82 97.34,28.95 87.25,28.95 IC1.51
VO+_FIL
  Top 0.203: IC1.30 76.24,29.1 71.12,23.98 68.8,23.98 U$5.P$12
VO-_BP_FIL
  Top 0.203: IC1.25 70.61,31.6 69.09,33.12 54.46,33.12 TP23.TP
VO-_CH  (via drill 0.6)
  Top 0.203: 96.2,29.45 96.22,29.46 v96.22,29.87 | v96.22,29.87 96.22,30.07 | v96.83,28.04 96.83,24.38 97.03,24.18 98.25,24.18 U$3.P$1 | IC1.52 95.95,29.6 v96.22,29.87
  Bottom 0.203: v96.83,28.04 96.22,28.65 v96.22,29.87
VO-_FIL  (via drill 0.6)
  Top 0.203: IC1.31 77.37,28.6 v74.78,26.01 | U$5.P$1 69.19,25.3 v69.9,26.01
  Bottom 0.203: v74.78,26.01 v69.9,26.01
VOCM  (via drill 0.6)
  Top 0.203: 31.52,20.9 32.72,19.71 35.54,19.71 IC14.6 | TP14.TP v45.11,24.99 | v80.06,29.46 80.47,29.06 80.47,27.47 IC1.36
  Top 0.406: C33.1 40.02,19.1 | 40.02,19.1 R11.2 40.02,24.99 TP14.TP | IC14.6 37.47,19.63 38,19.1 40.02,19.1 | IC14.2 31.52,20.9
  Route2 0.203: v45.11,24.99 48.36,24.99 50.6,22.76 71.93,22.76 78.64,29.46 v80.06,29.46
VOCM_1
  Top 0.203: IC4.4 28.18,8.19 29.46,6.91 30.39,6.91 IC15.3
VOCM_MUX
  Top 0.203: 22.15,16.05 22.15,18.69 21.27,19.57 IC3.4 30.41,19.62 IC14.3 | 22.15,16.05 22.15,15.44 | TP13.TP 21.59,15.09 21.54,15.04 21.54,15.44 22.15,16.05
VOUT_CSA
  Top 0.203: IC1.54 94.41,30.6 95.71,31.9 99.36,31.9 99.57,31.7 TP9.TP 100.69,31.9
VU  (3 unrouted)